# Altium project GL30_A_STM32_FOC_NO_TP.PrjPcb
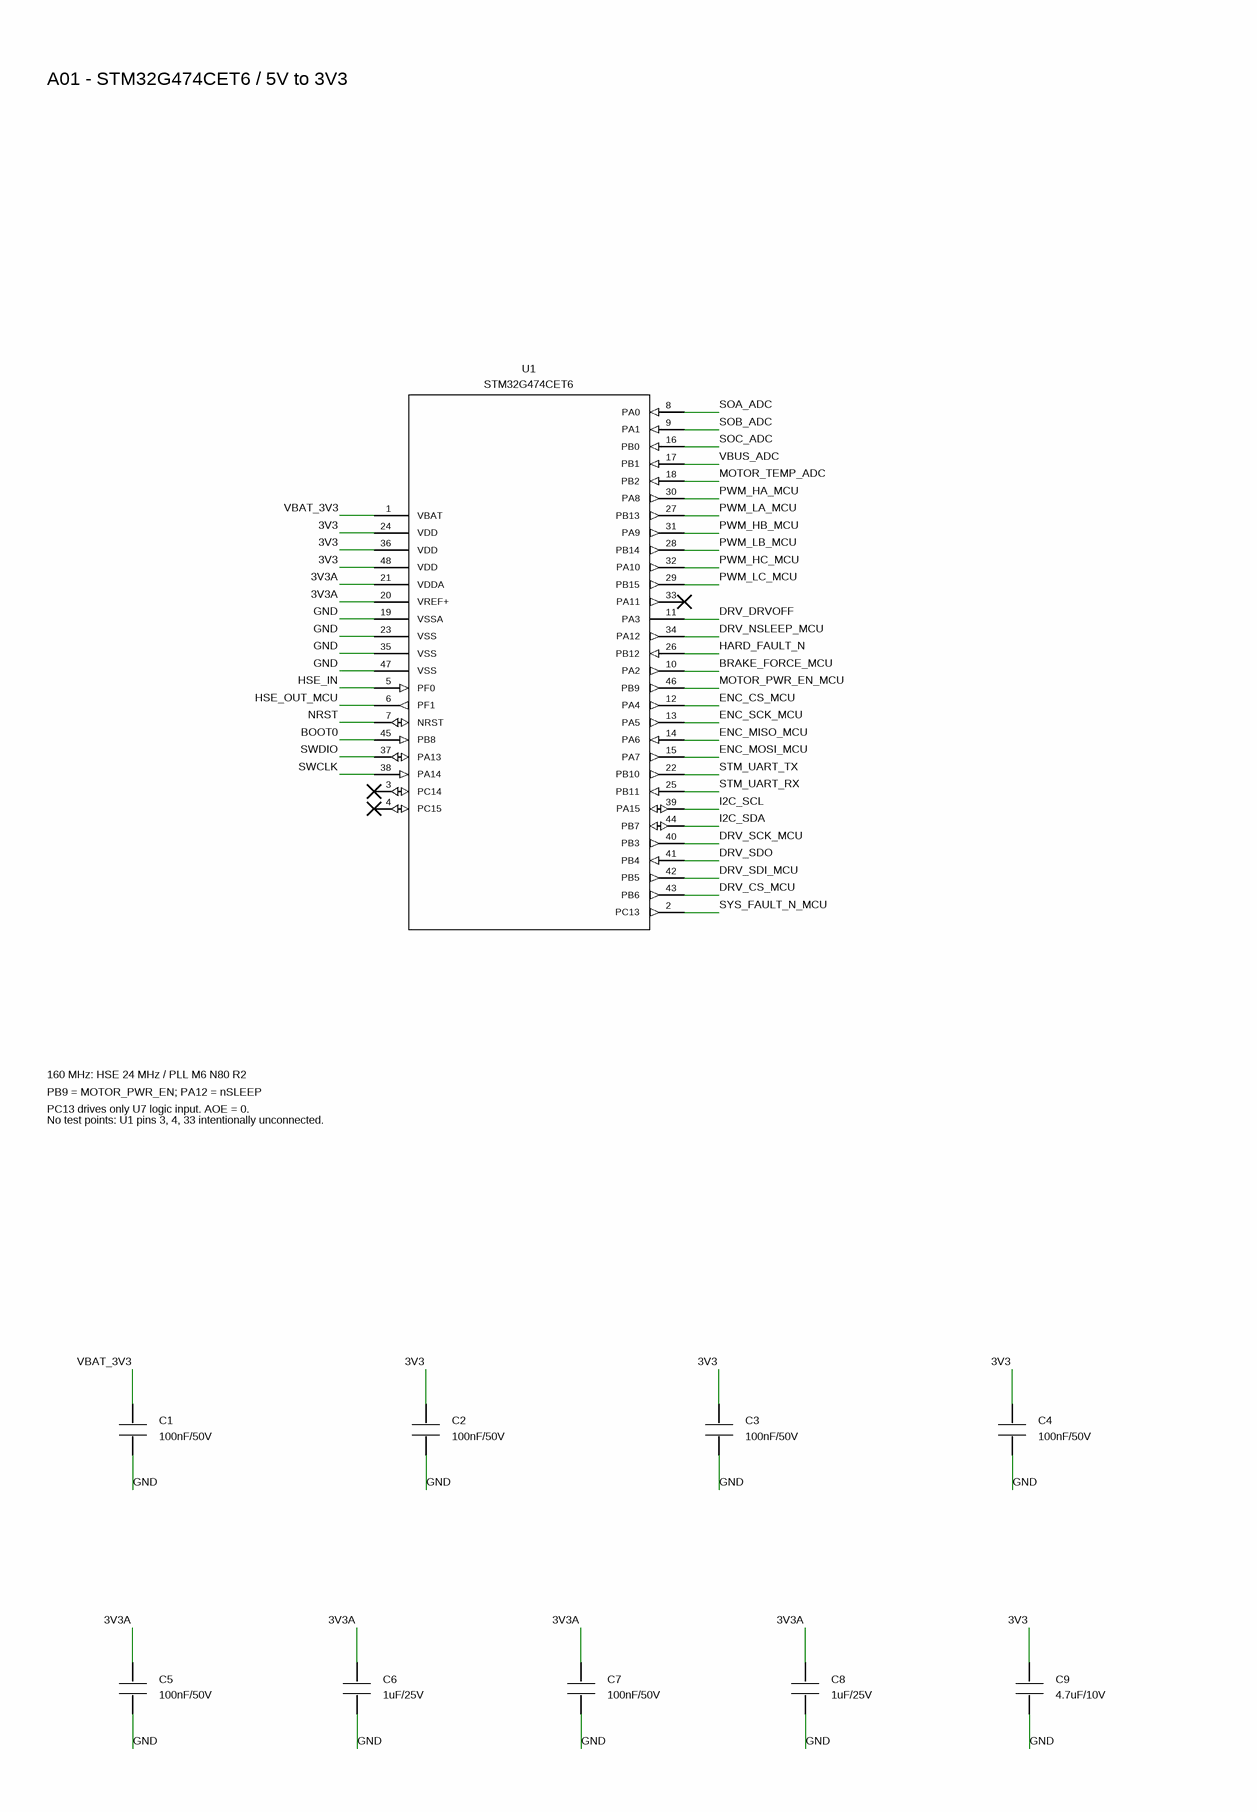
[diagram p0: A01_POWER_MCU.SchDoc, left]
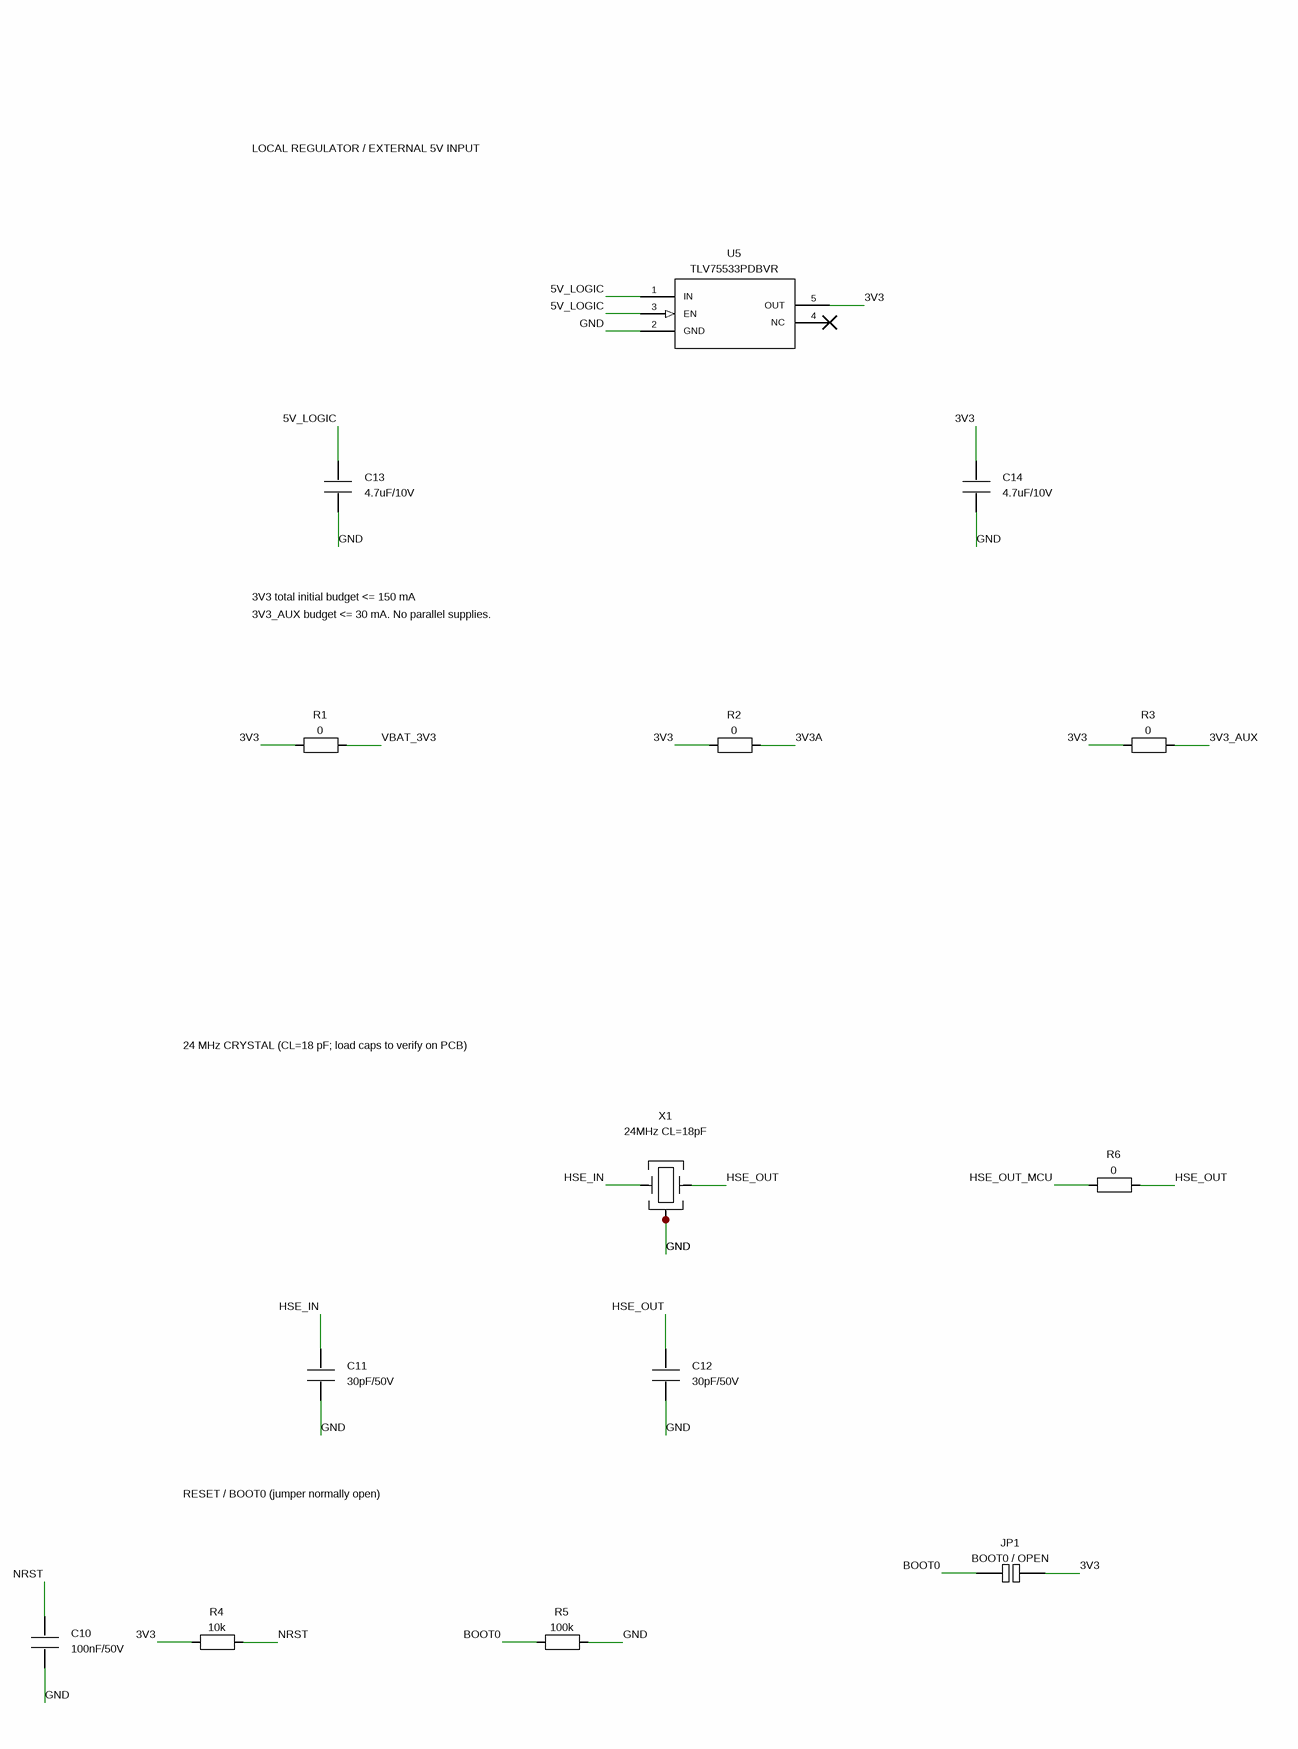
[diagram p1: A01_POWER_MCU.SchDoc, right]
Revision: A-SCH-AD-R6-USER-LIB-NO-TP
7 sheets, 146 parts. Net scope: global (net labels, ports and power ports of the same name join across sheets).
Sheets:
  A01_POWER_MCU.SchDoc
  A02_DRV8316.SchDoc
  A03_CURRENT_ADC.SchDoc
  A04_HARD_PROTECT.SchDoc
  A05_ENCODER_NTC.SchDoc
  A06_LINKS_POWER.SchDoc
  A07_BUS_CONTROL.SchDoc

## Sheet A01_POWER_MCU.SchDoc: A01_POWER_MCU
size 420 x 296 mm; Revision: A-SCH-AD-R2-NO-TP; SheetNumber: 1; SheetTotal: 7

### Parts
C1  100nF/50V  [C0603_M]
C2  100nF/50V  [C0603_M]
C3  100nF/50V  [C0603_M]
C4  100nF/50V  [C0603_M]
C5  100nF/50V  [C0603_M]
C6  1uF/25V  [C0603_M]
C7  100nF/50V  [C0603_M]
C8  1uF/25V  [C0603_M]
C9  4.7uF/10V  [C0805_M]
C10  100nF/50V  [C0603_M]
C11  30pF/50V  [C0603_M]
C12  30pF/50V  [C0603_M]
C13  4.7uF/10V  [C0805_M]
C14  4.7uF/10V  [C0805_M]
JP1  BOOT0 / OPEN
R1  0  [R0603_M]
R2  0  [R0805_M]
R3  0  [R0603_M]
R4  10k  [R0603_M]
R5  100k  [R0603_M]
R6  0  [R0603_M]
U1  STM32G474CET6  [QFP50P900X900X160-48N]
U5  TLV75533PDBVR  [SOT95P280X145-5N]
X1  24MHz CL=18pF  [XTAL-3225-4P]

### Nets
3V3: C2.1 C3.1 C4.1 C9.1 C14.1 JP1.2 R1.1 R2.1 R3.1 R4.1 U1.24(VDD) U1.36(VDD) U1.48(VDD) U5.5(OUT)
3V3_AUX: R3.2
3V3A: C5.1 C6.1 C7.1 C8.1 R2.2 U1.20(VREF+) U1.21(VDDA)
5V_LOGIC: C13.1 U5.1(IN) U5.3(EN)
BOOT0: JP1.1 R5.1 U1.45(PB8)
BRAKE_FORCE_MCU: U1.10(PA2)
DRV_CS_MCU: U1.43(PB6)
DRV_DRVOFF: U1.11(PA3)
DRV_NSLEEP_MCU: U1.34(PA12)
DRV_SCK_MCU: U1.40(PB3)
DRV_SDI_MCU: U1.42(PB5)
DRV_SDO: U1.41(PB4)
ENC_CS_MCU: U1.12(PA4)
ENC_MISO_MCU: U1.14(PA6)
ENC_MOSI_MCU: U1.15(PA7)
ENC_SCK_MCU: U1.13(PA5)
GND: C1.2 C2.2 C3.2 C4.2 C5.2 C6.2 C7.2 C8.2 C9.2 C10.2 C11.2 C12.2 C13.2 C14.2 R5.2 U1.19(VSSA) U1.23(VSS) U1.35(VSS) U1.47(VSS) U5.2(GND) X1.2(G) X1.4(G)
HARD_FAULT_N: U1.26(PB12)
HSE_IN: C11.1 U1.5(PF0) X1.1
HSE_OUT: C12.1 R6.2 X1.3
HSE_OUT_MCU: R6.1 U1.6(PF1)
I2C_SCL: U1.39(PA15)
I2C_SDA: U1.44(PB7)
MOTOR_PWR_EN_MCU: U1.46(PB9)
MOTOR_TEMP_ADC: U1.18(PB2)
NRST: C10.1 R4.2 U1.7(NRST)
PWM_HA_MCU: U1.30(PA8)
PWM_HB_MCU: U1.31(PA9)
PWM_HC_MCU: U1.32(PA10)
PWM_LA_MCU: U1.27(PB13)
PWM_LB_MCU: U1.28(PB14)
PWM_LC_MCU: U1.29(PB15)
SOA_ADC: U1.8(PA0)
SOB_ADC: U1.9(PA1)
SOC_ADC: U1.16(PB0)
STM_UART_RX: U1.25(PB11)
STM_UART_TX: U1.22(PB10)
SWCLK: U1.38(PA14)
SWDIO: U1.37(PA13)
SYS_FAULT_N_MCU: U1.2(PC13)
VBAT_3V3: C1.1 R1.2 U1.1(VBAT)
VBUS_ADC: U1.17(PB1)

Not connected (* = marked no-connect by the designer): U1 3(PC14)* 4(PC15)* 33(PA11)*; U5 4(NC)*

### Notes on the sheet
- A01 - STM32G474CET6 / 5V to 3V3
- LOCAL REGULATOR / EXTERNAL 5V INPUT
- 3V3 total initial budget <= 150 mA
- 3V3_AUX budget <= 30 mA. No parallel supplies.
- 160 MHz: HSE 24 MHz / PLL M6 N80 R2
- PB9 = MOTOR_PWR_EN; PA12 = nSLEEP
- PC13 drives only U7 logic input. AOE = 0.
- No test points: U1 pins 3, 4, 33 intentionally unconnected.
- 24 MHz CRYSTAL (CL=18 pF; load caps to verify on PCB)
- RESET / BOOT0 (jumper normally open)

### Library data of the parts
C1 C10 = C: 电容; MPN: CL10B104KB8NNNC; Source_KiCad_Footprint: GL30:C_0603_1608Metric; Specification: 100 nF / 50 V X7R; Assembly: FITTED; PCB_Model_Status: USER_LIBRARY_LINKED_PIN_NUMBERS_CHECKED; Package: 0603; Footprint_status: LIBRARY_SELECTED_PENDING_LAYOUT_REVIEW; Value: 100nF/50V
C2 = C: 电容; MPN: CL10B104KB8NNNC; Source_KiCad_Footprint: GL30:C_0603_1608Metric; Specification: 100 nF / 50 V X7R; Design_note: 对应U1 VDD脚24; Assembly: FITTED; PCB_Model_Status: USER_LIBRARY_LINKED_PIN_NUMBERS_CHECKED; Package: 0603; Footprint_status: LIBRARY_SELECTED_PENDING_LAYOUT_REVIEW; Value: 100nF/50V
C3 = C: 电容; MPN: CL10B104KB8NNNC; Source_KiCad_Footprint: GL30:C_0603_1608Metric; Specification: 100 nF / 50 V X7R; Design_note: 对应U1 VDD脚36; Assembly: FITTED; PCB_Model_Status: USER_LIBRARY_LINKED_PIN_NUMBERS_CHECKED; Package: 0603; Footprint_status: LIBRARY_SELECTED_PENDING_LAYOUT_REVIEW; Value: 100nF/50V
C4 = C: 电容; MPN: CL10B104KB8NNNC; Source_KiCad_Footprint: GL30:C_0603_1608Metric; Specification: 100 nF / 50 V X7R; Design_note: 对应U1 VDD脚48; Assembly: FITTED; PCB_Model_Status: USER_LIBRARY_LINKED_PIN_NUMBERS_CHECKED; Package: 0603; Footprint_status: LIBRARY_SELECTED_PENDING_LAYOUT_REVIEW; Value: 100nF/50V
C5 = C: 电容; MPN: CL10B104KB8NNNC; Source_KiCad_Footprint: GL30:C_0603_1608Metric; Specification: 100 nF / 50 V X7R; Design_note: U1.21 VDDA; Assembly: FITTED; PCB_Model_Status: USER_LIBRARY_LINKED_PIN_NUMBERS_CHECKED; Package: 0603; Footprint_status: LIBRARY_SELECTED_PENDING_LAYOUT_REVIEW; Value: 100nF/50V
C6 = C: 电容; MPN: CL10A105KA8NNNC; Source_KiCad_Footprint: GL30:C_0603_1608Metric; Specification: 1 µF / 25 V X5R; Design_note: U1.21 VDDA; Assembly: FITTED; PCB_Model_Status: USER_LIBRARY_LINKED_PIN_NUMBERS_CHECKED; Package: 0603; Footprint_status: LIBRARY_SELECTED_PENDING_LAYOUT_REVIEW; Value: 1uF/25V
C7 = C: 电容; MPN: CL10B104KB8NNNC; Source_KiCad_Footprint: GL30:C_0603_1608Metric; Specification: 100 nF / 50 V X7R; Design_note: U1.20 VREF+; Assembly: FITTED; PCB_Model_Status: USER_LIBRARY_LINKED_PIN_NUMBERS_CHECKED; Package: 0603; Footprint_status: LIBRARY_SELECTED_PENDING_LAYOUT_REVIEW; Value: 100nF/50V
C8 = C: 电容; MPN: CL10A105KA8NNNC; Source_KiCad_Footprint: GL30:C_0603_1608Metric; Specification: 1 µF / 25 V X5R; Design_note: U1.20 VREF+; Assembly: FITTED; PCB_Model_Status: USER_LIBRARY_LINKED_PIN_NUMBERS_CHECKED; Package: 0603; Footprint_status: LIBRARY_SELECTED_PENDING_LAYOUT_REVIEW; Value: 1uF/25V
C9 = C: 电容; MPN: 通用 0805 4.7 µF 10 V X7R; Source_KiCad_Footprint: GL30:C_0805_2012Metric; Specification: 4.7 µF / 10 V X7R; Design_note: MCU附近; Assembly: FITTED; PCB_Model_Status: USER_LIBRARY_LINKED_PIN_NUMBERS_CHECKED; Package: 0805; Footprint_status: LIBRARY_SELECTED_PENDING_LAYOUT_REVIEW; Value: 4.7uF/10V
C11 = C: 电容; MPN: 通用 0603 30 pF 50 V C0G; Source_KiCad_Footprint: GL30:C_0603_1608Metric; Specification: 30 pF / 50 V C0G ±5%; Design_note: X1 CL=18pF，按寄生3pF估算；起振后复核; Assembly: FITTED; PCB_Model_Status: USER_LIBRARY_LINKED_PIN_NUMBERS_CHECKED; Package: 0603; Footprint_status: LIBRARY_SELECTED_PENDING_LAYOUT_REVIEW; Value: 30pF/50V
C12 = C: 电容; MPN: 通用 0603 30 pF 50 V C0G; Source_KiCad_Footprint: GL30:C_0603_1608Metric; Specification: 30 pF / 50 V C0G ±5%; Design_note: 不可把晶体CL直接当作单颗负载电容值; Assembly: FITTED; PCB_Model_Status: USER_LIBRARY_LINKED_PIN_NUMBERS_CHECKED; Package: 0603; Footprint_status: LIBRARY_SELECTED_PENDING_LAYOUT_REVIEW; Value: 30pF/50V
C13 = C: 电容; MPN: 通用 0805 4.7 µF 10 V X7R; Source_KiCad_Footprint: GL30:C_0805_2012Metric; Specification: 4.7 µF / 10 V X7R; Design_note: U5输入，有效容量≥1µF; Assembly: FITTED; PCB_Model_Status: USER_LIBRARY_LINKED_PIN_NUMBERS_CHECKED; Package: 0805; Footprint_status: LIBRARY_SELECTED_PENDING_LAYOUT_REVIEW; Value: 4.7uF/10V
C14 = C: 电容; MPN: 通用 0805 4.7 µF 10 V X7R; Source_KiCad_Footprint: GL30:C_0805_2012Metric; Specification: 4.7 µF / 10 V X7R; Design_note: U5输出，有效容量≥1µF; Assembly: FITTED; PCB_Model_Status: USER_LIBRARY_LINKED_PIN_NUMBERS_CHECKED; Package: 0805; Footprint_status: LIBRARY_SELECTED_PENDING_LAYOUT_REVIEW; Value: 4.7uF/10V
JP1 = SolderJumper_2_Open: BOOT焊桥; MPN: PCB焊盘，无采购; Source_KiCad_Footprint: GL30:SolderJumper-2_P1.3mm_Open_RoundedPad1.0x1.5mm; Specification: 默认断开; Design_note: 只在烧录/救援时短接; Assembly: DNP_OR_DIRECT_WIRE_PADS; PCB_Model_Status: NOT_ASSIGNED_IN_ALTIUM_SCHEMATIC_DELIVERY; Package: 2焊盘焊桥; Footprint_status: LIBRARY_SELECTED_PENDING_LAYOUT_REVIEW; Value: BOOT0 / OPEN
R1 = R: 电阻; MPN: 通用0Ω跳线 0.1 W; Source_KiCad_Footprint: GL30:R_0603_1608Metric; Specification: 0 Ω跳线；0.1 W; Assembly: FITTED; PCB_Model_Status: USER_LIBRARY_LINKED_PIN_NUMBERS_CHECKED; Package: 0603; Footprint_status: LIBRARY_SELECTED_PENDING_LAYOUT_REVIEW; Value: 0
R2 = R: 电阻; MPN: 通用0Ω跳线 0.125 W; Source_KiCad_Footprint: GL30:R_0805_2012Metric; Specification: 0 Ω跳线；0.125 W; Design_note: 0805磁珠兼容焊盘；首装0Ω，不将模拟地割裂; Assembly: FITTED; PCB_Model_Status: USER_LIBRARY_LINKED_PIN_NUMBERS_CHECKED; Package: 0805; Footprint_status: LIBRARY_SELECTED_PENDING_LAYOUT_REVIEW; Value: 0
R3 = R: 电阻; MPN: 通用0Ω跳线 0.1 W; Source_KiCad_Footprint: GL30:R_0603_1608Metric; Specification: 0 Ω跳线；0.1 W; Design_note: 可拆以单独测B/C传感器电流; Assembly: FITTED; PCB_Model_Status: USER_LIBRARY_LINKED_PIN_NUMBERS_CHECKED; Package: 0603; Footprint_status: LIBRARY_SELECTED_PENDING_LAYOUT_REVIEW; Value: 0
R4 = R: 电阻; MPN: 通用厚膜 10k 1% 0.1 W; Source_KiCad_Footprint: GL30:R_0603_1608Metric; Specification: 10k Ω；1%；0.1 W; Assembly: FITTED; PCB_Model_Status: USER_LIBRARY_LINKED_PIN_NUMBERS_CHECKED; Package: 0603; Footprint_status: LIBRARY_SELECTED_PENDING_LAYOUT_REVIEW; Value: 10k
R5 = R: 电阻; MPN: 通用厚膜 100k 1% 0.1 W; Source_KiCad_Footprint: GL30:R_0603_1608Metric; Specification: 100k Ω；1%；0.1 W; Assembly: FITTED; PCB_Model_Status: USER_LIBRARY_LINKED_PIN_NUMBERS_CHECKED; Package: 0603; Footprint_status: LIBRARY_SELECTED_PENDING_LAYOUT_REVIEW; Value: 100k
R6 = R: 电阻; MPN: 通用0Ω跳线 0.1 W; Source_KiCad_Footprint: GL30:R_0603_1608Metric; Specification: 0 Ω跳线；0.1 W; Design_note: 晶体驱动调试位置，首装0Ω; Assembly: FITTED; PCB_Model_Status: USER_LIBRARY_LINKED_PIN_NUMBERS_CHECKED; Package: 0603; Footprint_status: LIBRARY_SELECTED_PENDING_LAYOUT_REVIEW; Value: 0
U1 = STM32G474CET6: FOC主控; Source_KiCad_Footprint: GL30:LQFP-48_7x7mm_P0.5mm; Design_note: 必须选CET6；不是NUCLEO上的RET6; Assembly: FITTED; PCB_Model_Status: USER_LIBRARY_LINKED_PIN_NUMBERS_CHECKED; Datasheet: https://www.st.com/resource/en/datasheet/stm32g474ce.pdf; MPN: STM32G474CET6; Package: LQFP48 7×7 mm，0.5 mm; Specification: STM32G474CET6; Footprint_status: LIBRARY_SELECTED_PENDING_LAYOUT_REVIEW; Value: STM32G474CET6
U5 = TLV75533PDBVR: 本地3.3 V稳压; Source_KiCad_Footprint: GL30:SOT-23-5; Design_note: 原B板B10不删除；本板3V3禁止与B/ESP的独立3V3并联; Assembly: FITTED; PCB_Model_Status: USER_LIBRARY_LINKED_PIN_NUMBERS_CHECKED; Datasheet: https://www.ti.com/lit/ds/symlink/tlv755p.pdf; MPN: TLV75533PDBVR; Package: DBV SOT-23-5; Specification: TLV75533PDBVR; Footprint_status: LIBRARY_SELECTED_PENDING_LAYOUT_REVIEW; Value: TLV75533PDBVR
X1 = Crystal_GND24: 无源晶体; MPN: ABM8-24.000MHZ-B2-T; Source_KiCad_Footprint: GL30:Crystal_SMD_3225-4Pin_3.2x2.5mm; Specification: 24 MHz；CL18 pF; Design_note: 1/3晶体，2/4外壳地；不可按倒角判1脚; Assembly: FITTED; PCB_Model_Status: USER_LIBRARY_LINKED_PIN_NUMBERS_CHECKED; Package: 3225 4焊盘; Footprint_status: LIBRARY_SELECTED_PENDING_LAYOUT_REVIEW; Value: 24MHz CL=18pF

## Sheet A02_DRV8316.SchDoc: A02_DRV8316
size 420 x 296 mm; Revision: A-SCH-AD-R2-NO-TP; SheetNumber: 2; SheetTotal: 7
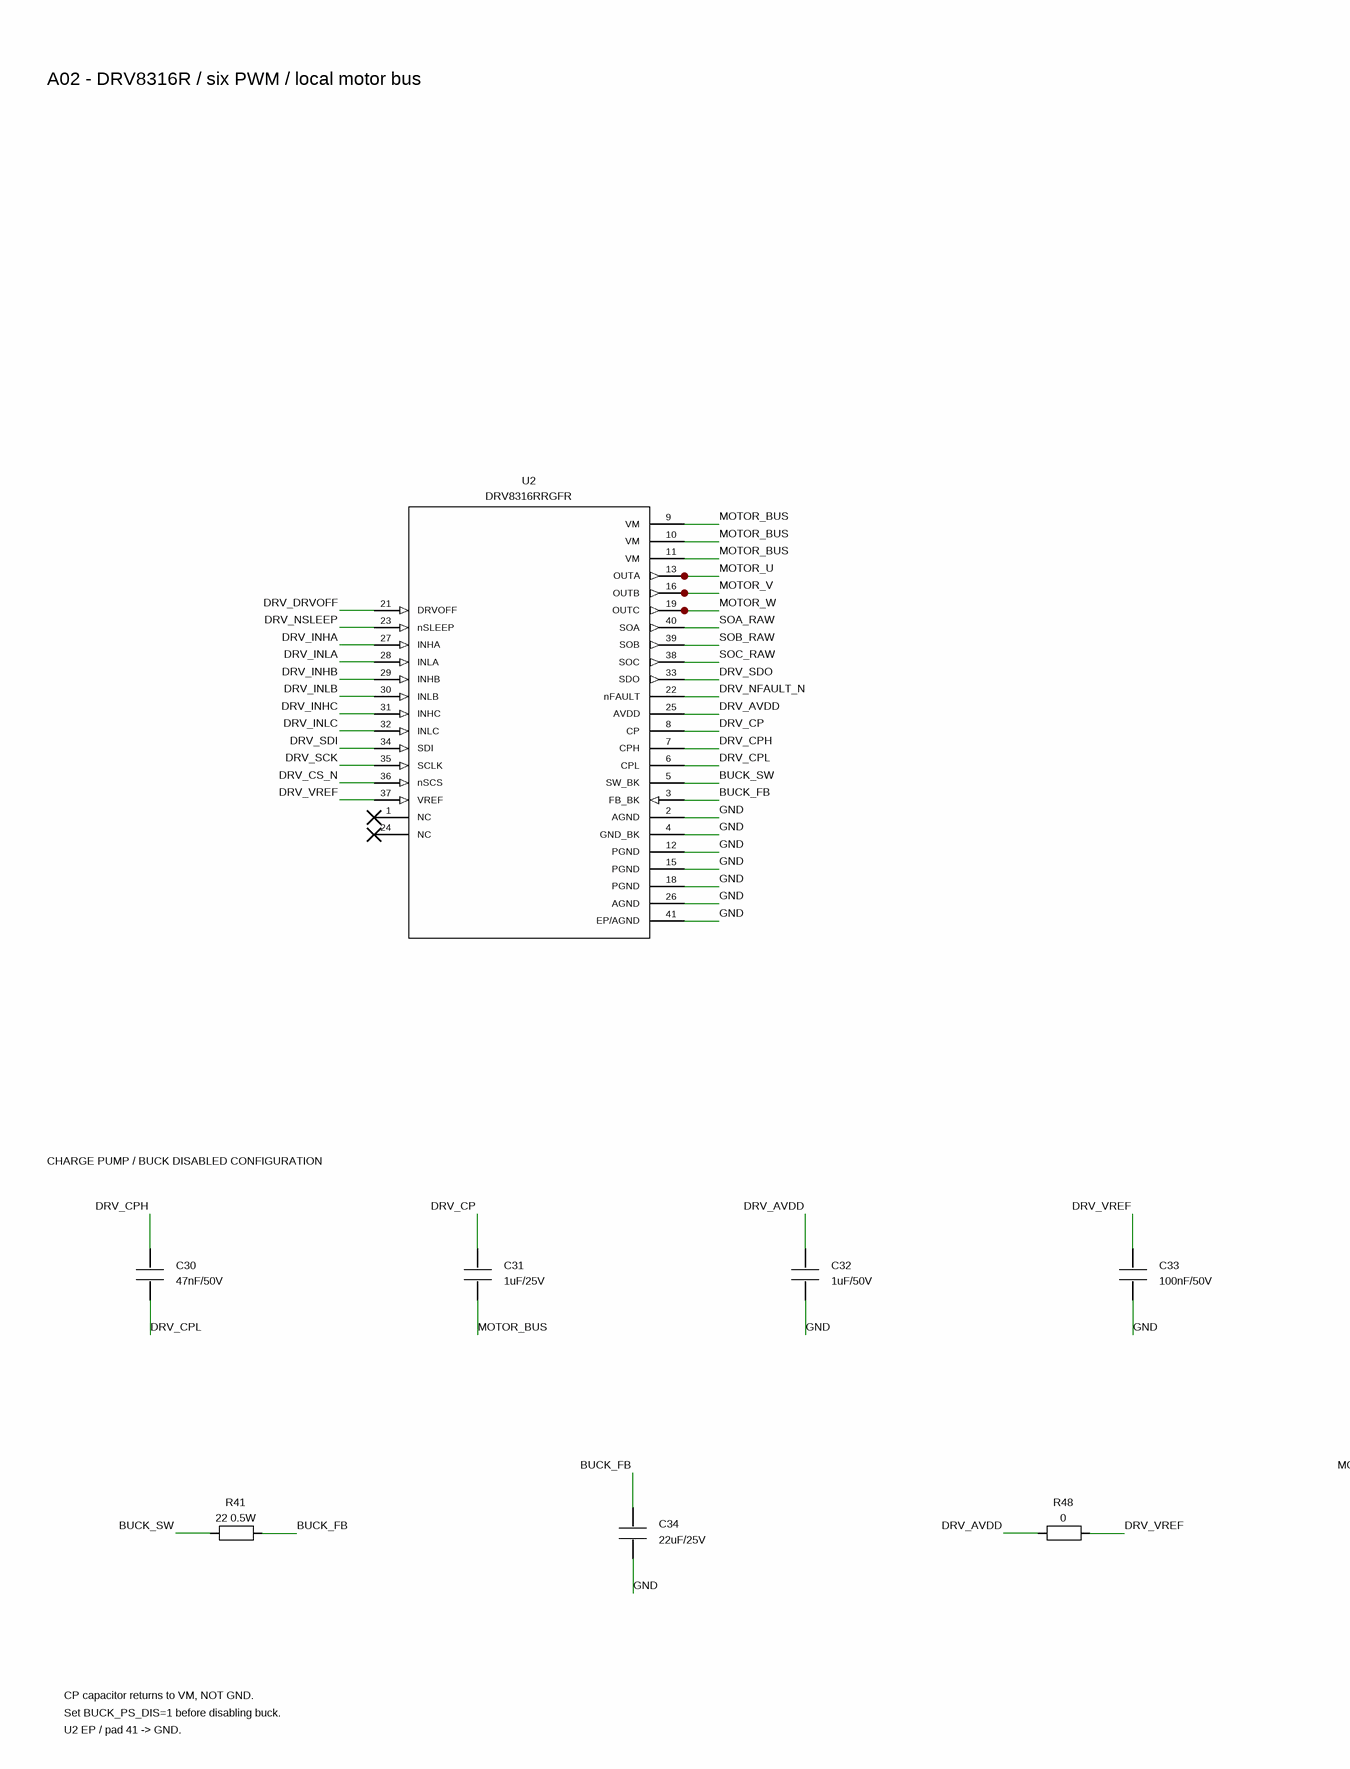
[diagram p2: A02_DRV8316.SchDoc, left]
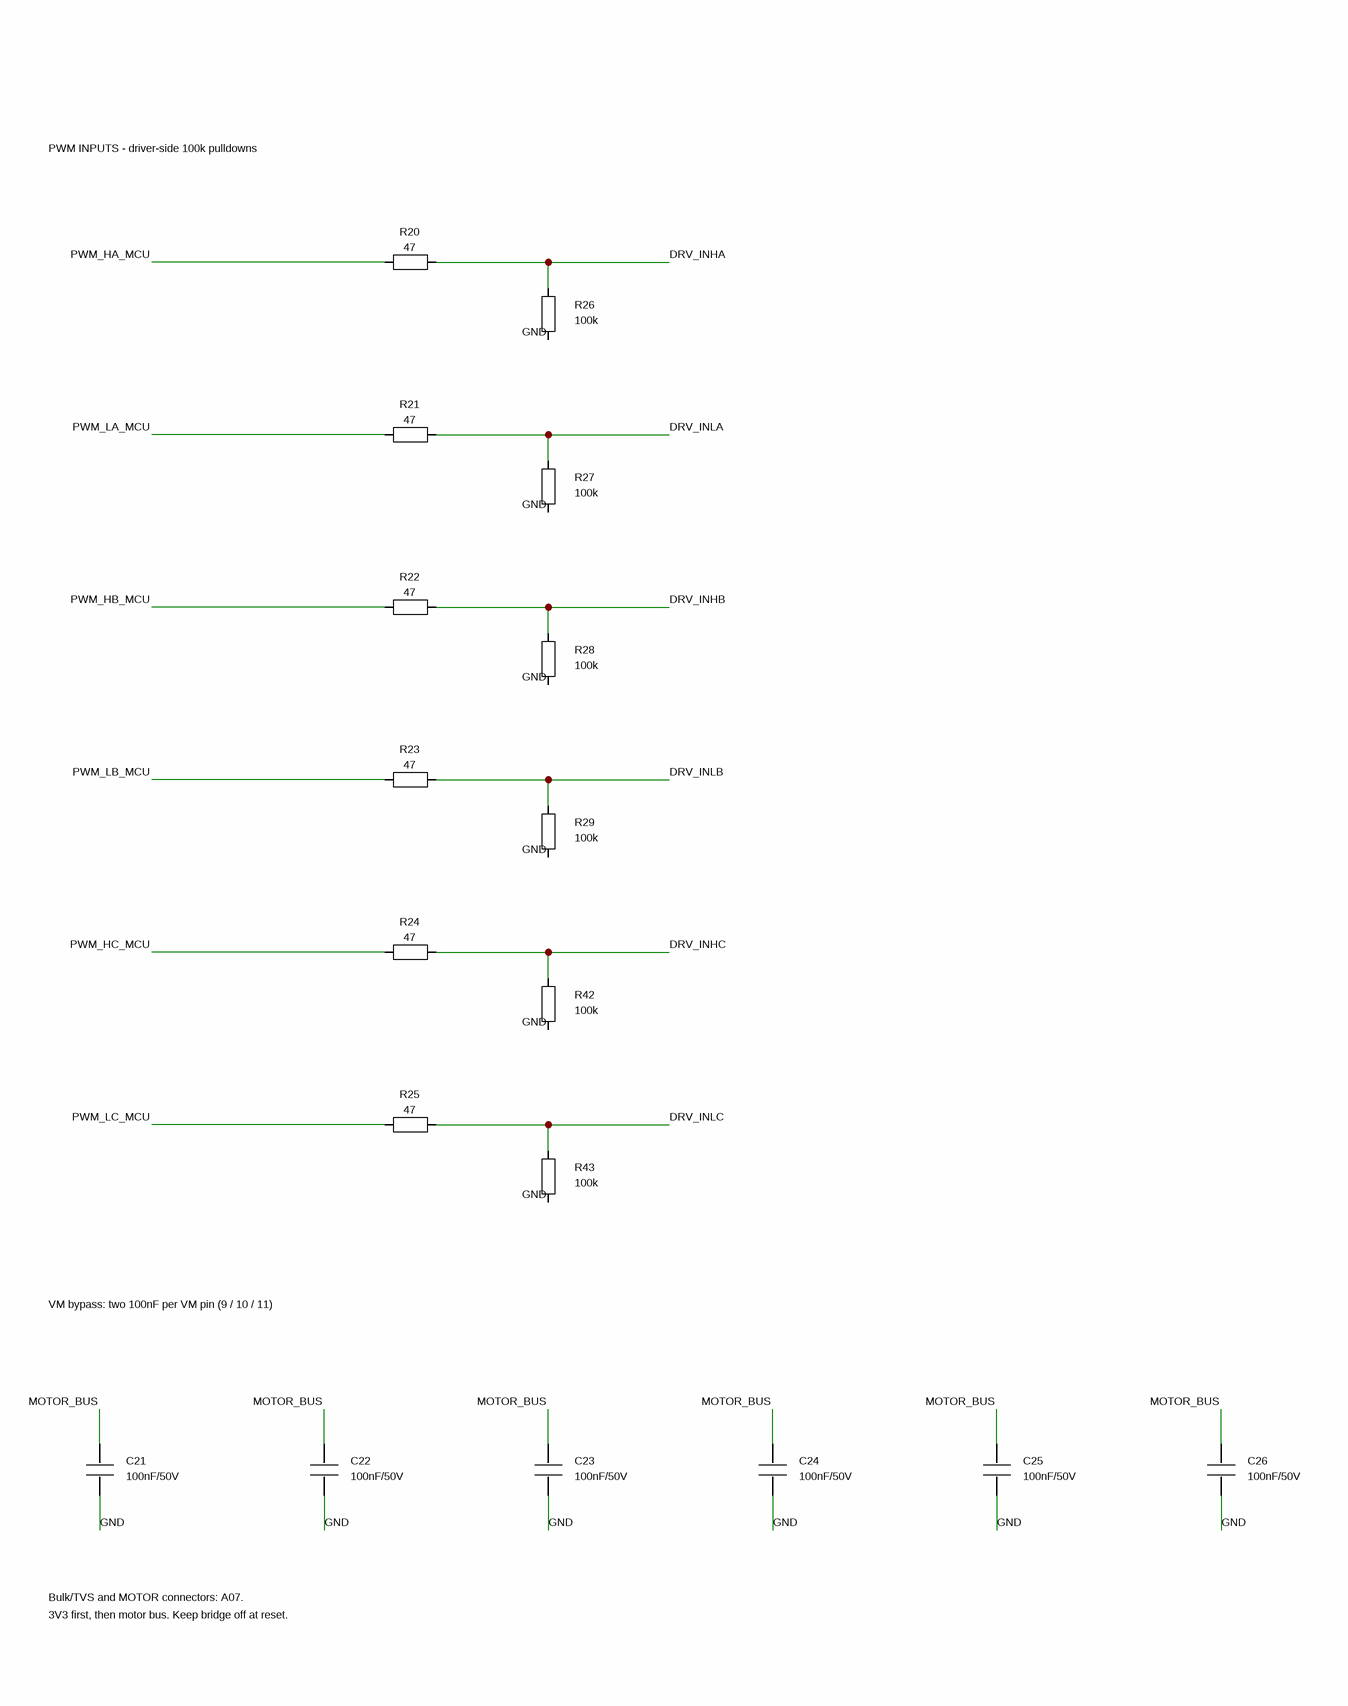
[diagram p3: A02_DRV8316.SchDoc, right]

### Parts
C21  100nF/50V  [C0603_M]
C22  100nF/50V  [C0603_M]
C23  100nF/50V  [C0603_M]
C24  100nF/50V  [C0603_M]
C25  100nF/50V  [C0603_M]
C26  100nF/50V  [C0603_M]
C30  47nF/50V  [C0603_M]
C31  1uF/25V  [C0603_M]
C32  1uF/50V  [C0805_M]
C33  100nF/50V  [C0603_M]
C34  22uF/25V  [C0805_M]
R20  47  [R0603_M]
R21  47  [R0603_M]
R22  47  [R0603_M]
R23  47  [R0603_M]
R24  47  [R0603_M]
R25  47  [R0603_M]
R26  100k  [R0603_M]
R27  100k  [R0603_M]
R28  100k  [R0603_M]
R29  100k  [R0603_M]
R41  22 0.5W  [RESC3116X65N]
R42  100k  [R0603_M]
R43  100k  [R0603_M]
R48  0  [R0603_M]
U2  DRV8316RRGFR  [C5218861_VQFN-40_5x7]

### Nets
BUCK_FB: C34.1 R41.2 U2.3(FB_BK)
BUCK_SW: R41.1 U2.5(SW_BK)
DRV_AVDD: C32.1 R48.1 U2.25(AVDD)
DRV_CP: C31.1 U2.8(CP)
DRV_CPH: C30.1 U2.7(CPH)
DRV_CPL: C30.2 U2.6(CPL)
DRV_CS_N: U2.36(nSCS)
DRV_DRVOFF: U2.21(DRVOFF)
DRV_INHA: R20.2 R26.1 U2.27(INHA)
DRV_INHB: R22.2 R28.1 U2.29(INHB)
DRV_INHC: R24.2 R42.1 U2.31(INHC)
DRV_INLA: R21.2 R27.1 U2.28(INLA)
DRV_INLB: R23.2 R29.1 U2.30(INLB)
DRV_INLC: R25.2 R43.1 U2.32(INLC)
DRV_NFAULT_N: U2.22(nFAULT)
DRV_NSLEEP: U2.23(nSLEEP)
DRV_SCK: U2.35(SCLK)
DRV_SDI: U2.34(SDI)
DRV_SDO: U2.33(SDO)
DRV_VREF: C33.1 R48.2 U2.37(VREF)
GND: C21.2 C22.2 C23.2 C24.2 C25.2 C26.2 C32.2 C33.2 C34.2 R26.2 R27.2 R28.2 R29.2 R42.2 R43.2 U2.2(AGND) U2.4(GND_BK) U2.12(PGND) U2.15(PGND) U2.18(PGND) U2.26(AGND) U2.41(EP/AGND)
MOTOR_BUS: C21.1 C22.1 C23.1 C24.1 C25.1 C26.1 C31.2 U2.9(VM) U2.10(VM) U2.11(VM)
MOTOR_U: U2.13(OUTA) U2.14(OUTA)
MOTOR_V: U2.16(OUTB) U2.17(OUTB)
MOTOR_W: U2.19(OUTC) U2.20(OUTC)
PWM_HA_MCU: R20.1
PWM_HB_MCU: R22.1
PWM_HC_MCU: R24.1
PWM_LA_MCU: R21.1
PWM_LB_MCU: R23.1
PWM_LC_MCU: R25.1
SOA_RAW: U2.40(SOA)
SOB_RAW: U2.39(SOB)
SOC_RAW: U2.38(SOC)

Not connected (* = marked no-connect by the designer): U2 1(NC)* 24(NC)*

### Notes on the sheet
- A02 - DRV8316R / six PWM / local motor bus
- PWM INPUTS - driver-side 100k pulldowns
- CHARGE PUMP / BUCK DISABLED CONFIGURATION
- VM bypass: two 100nF per VM pin (9 / 10 / 11)
- CP capacitor returns to VM, NOT GND.
- Bulk/TVS and MOTOR connectors: A07.
- 3V3 first, then motor bus. Keep bridge off at reset.
- Set BUCK_PS_DIS=1 before disabling buck.
- U2 EP / pad 41 -> GND.

### Library data of the parts
C21 = C: 电容; MPN: CL10B104KB8NNNC; Source_KiCad_Footprint: GL30:C_0603_1608Metric; Specification: 100 nF / 50 V X7R; Design_note: VM脚9的第1颗，就近; Assembly: FITTED; PCB_Model_Status: USER_LIBRARY_LINKED_PIN_NUMBERS_CHECKED; Package: 0603; Footprint_status: LIBRARY_SELECTED_PENDING_LAYOUT_REVIEW; Value: 100nF/50V
C22 = C: 电容; MPN: CL10B104KB8NNNC; Source_KiCad_Footprint: GL30:C_0603_1608Metric; Specification: 100 nF / 50 V X7R; Design_note: VM脚9的第2颗，就近; Assembly: FITTED; PCB_Model_Status: USER_LIBRARY_LINKED_PIN_NUMBERS_CHECKED; Package: 0603; Footprint_status: LIBRARY_SELECTED_PENDING_LAYOUT_REVIEW; Value: 100nF/50V
C23 = C: 电容; MPN: CL10B104KB8NNNC; Source_KiCad_Footprint: GL30:C_0603_1608Metric; Specification: 100 nF / 50 V X7R; Design_note: VM脚10的第1颗，就近; Assembly: FITTED; PCB_Model_Status: USER_LIBRARY_LINKED_PIN_NUMBERS_CHECKED; Package: 0603; Footprint_status: LIBRARY_SELECTED_PENDING_LAYOUT_REVIEW; Value: 100nF/50V
C24 = C: 电容; MPN: CL10B104KB8NNNC; Source_KiCad_Footprint: GL30:C_0603_1608Metric; Specification: 100 nF / 50 V X7R; Design_note: VM脚10的第2颗，就近; Assembly: FITTED; PCB_Model_Status: USER_LIBRARY_LINKED_PIN_NUMBERS_CHECKED; Package: 0603; Footprint_status: LIBRARY_SELECTED_PENDING_LAYOUT_REVIEW; Value: 100nF/50V
C25 = C: 电容; MPN: CL10B104KB8NNNC; Source_KiCad_Footprint: GL30:C_0603_1608Metric; Specification: 100 nF / 50 V X7R; Design_note: VM脚11的第1颗，就近; Assembly: FITTED; PCB_Model_Status: USER_LIBRARY_LINKED_PIN_NUMBERS_CHECKED; Package: 0603; Footprint_status: LIBRARY_SELECTED_PENDING_LAYOUT_REVIEW; Value: 100nF/50V
C26 = C: 电容; MPN: CL10B104KB8NNNC; Source_KiCad_Footprint: GL30:C_0603_1608Metric; Specification: 100 nF / 50 V X7R; Design_note: VM脚11的第2颗，就近; Assembly: FITTED; PCB_Model_Status: USER_LIBRARY_LINKED_PIN_NUMBERS_CHECKED; Package: 0603; Footprint_status: LIBRARY_SELECTED_PENDING_LAYOUT_REVIEW; Value: 100nF/50V
C30 = C: 电容; MPN: CL10B473KB8NNNC; Source_KiCad_Footprint: GL30:C_0603_1608Metric; Specification: 47 nF / 50 V X7R; Design_note: 飞跨电容；不是接地; Assembly: FITTED; PCB_Model_Status: USER_LIBRARY_LINKED_PIN_NUMBERS_CHECKED; Package: 0603; Footprint_status: LIBRARY_SELECTED_PENDING_LAYOUT_REVIEW; Value: 47nF/50V
C31 = C: 电容; MPN: CL10A105KA8NNNC; Source_KiCad_Footprint: GL30:C_0603_1608Metric; Specification: 1 µF / 25 V X5R; Design_note: 充电泵电容；不是CP接地; Assembly: FITTED; PCB_Model_Status: USER_LIBRARY_LINKED_PIN_NUMBERS_CHECKED; Package: 0603; Footprint_status: LIBRARY_SELECTED_PENDING_LAYOUT_REVIEW; Value: 1uF/25V
C32 = C: 电容; MPN: CL21B105KBFNNNE; Source_KiCad_Footprint: GL30:C_0805_2012Metric; Specification: 1 µF / 50 V X7R; Design_note: 需在3.3V/全温下有效0.7–1.3µF；按实购曲线复核; Assembly: FITTED; PCB_Model_Status: USER_LIBRARY_LINKED_PIN_NUMBERS_CHECKED; Package: 0805; Footprint_status: LIBRARY_SELECTED_PENDING_LAYOUT_REVIEW; Value: 1uF/50V
C33 = C: as C1 on sheet A01_POWER_MCU; Package: 0603; Footprint_status: LIBRARY_SELECTED_PENDING_LAYOUT_REVIEW; Value: 100nF/50V
C34 = C: 电容; MPN: CL21A226MAQNNNE; Source_KiCad_Footprint: GL30:C_0805_2012Metric; Specification: 22 µF / 25 V X5R; Design_note: 内部Buck未使用仍装；5V_LOGIC不能接这里; Assembly: FITTED; PCB_Model_Status: USER_LIBRARY_LINKED_PIN_NUMBERS_CHECKED; Package: 0805; Footprint_status: LIBRARY_SELECTED_PENDING_LAYOUT_REVIEW; Value: 22uF/25V
R20-R25 = R: 电阻; MPN: 通用厚膜 47 1% 0.1 W; Source_KiCad_Footprint: GL30:R_0603_1608Metric; Specification: 47 Ω；1%；0.1 W; Assembly: FITTED; PCB_Model_Status: USER_LIBRARY_LINKED_PIN_NUMBERS_CHECKED; Package: 0603; Footprint_status: LIBRARY_SELECTED_PENDING_LAYOUT_REVIEW; Value: 47
R26-R29 R42 R43 = R: 电阻; MPN: 通用厚膜 100k 1% 0.1 W; Source_KiCad_Footprint: GL30:R_0603_1608Metric; Specification: 100k Ω；1%；0.1 W; Design_note: 放驱动器侧; Assembly: FITTED; PCB_Model_Status: USER_LIBRARY_LINKED_PIN_NUMBERS_CHECKED; Package: 0603; Footprint_status: LIBRARY_SELECTED_PENDING_LAYOUT_REVIEW; Value: 100k
R41 = R: 电阻; MPN: 通用厚膜 22 1% 0.5 W; Source_KiCad_Footprint: GL30:R_1206_3216Metric; Specification: 22 Ω；1%；0.5 W; Design_note: 内部Buck不用也保留；脉冲型≥0.5W，不能替成0603; Assembly: FITTED; PCB_Model_Status: USER_LIBRARY_LINKED_PIN_NUMBERS_CHECKED; Package: 1206; Footprint_status: LIBRARY_SELECTED_PENDING_LAYOUT_REVIEW; Value: 22 0.5W
R48 = R: as R1 on sheet A01_POWER_MCU; Package: 0603; Footprint_status: LIBRARY_SELECTED_PENDING_LAYOUT_REVIEW; Value: 0
U2 = DRV8316RRGFR: 三相集成驱动; Design_note: R版SPI；每个VM脚配2颗100n；裸露焊盘必须接地; Assembly: FITTED; PCB_Model_Status: USER_LIBRARY_LINKED_PIN_NUMBERS_CHECKED; Datasheet: https://www.ti.com/lit/ds/symlink/drv8316.pdf; MPN: DRV8316RRGFR; Package: RGF VQFN40 7×5 mm + EP; Specification: DRV8316RRGFR; Footprint_status: PENDING_PHYSICAL_FOOTPRINT_REVIEW; Value: DRV8316RRGFR

## Sheet A03_CURRENT_ADC.SchDoc: A03_CURRENT_ADC
size 420 x 296 mm; Revision: A-SCH-AD-R2-NO-TP; SheetNumber: 3; SheetTotal: 7
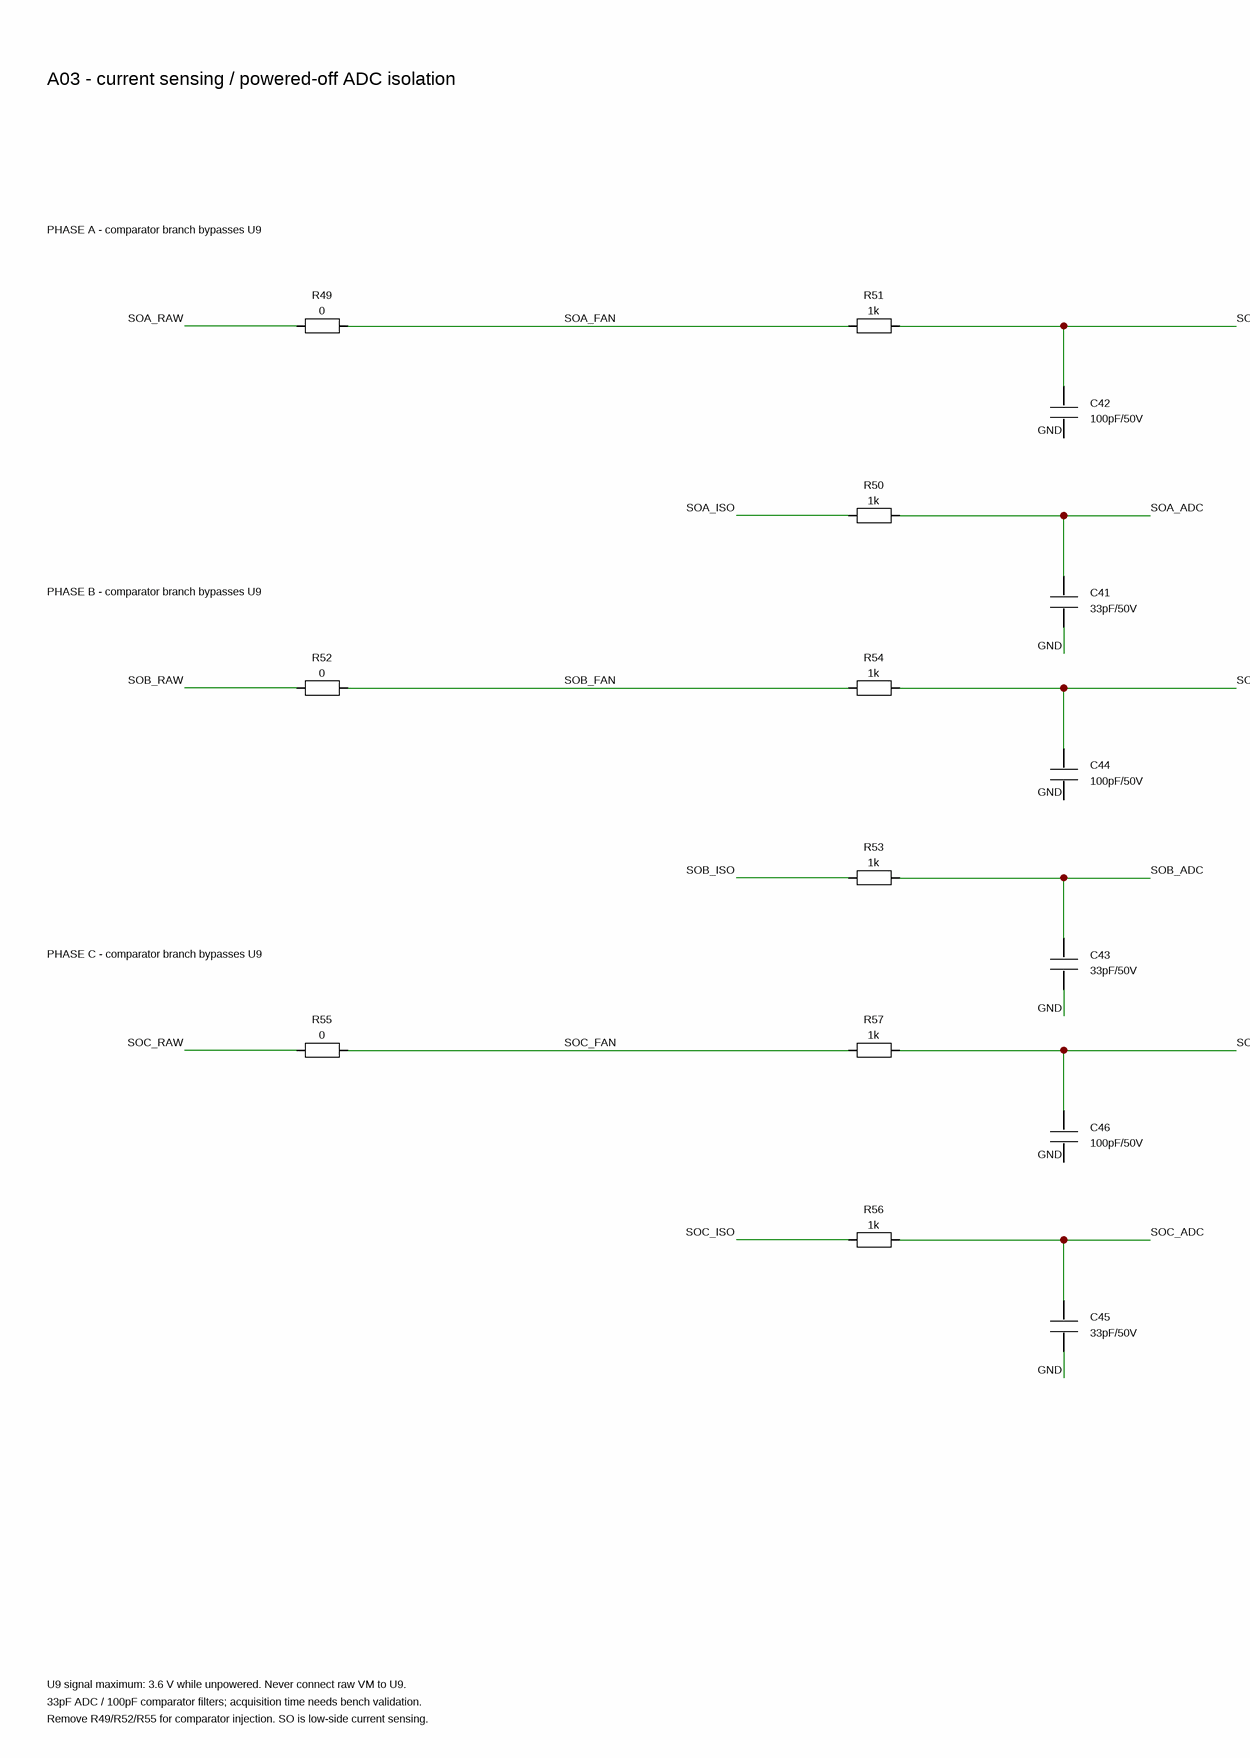
[diagram p4: A03_CURRENT_ADC.SchDoc, left]
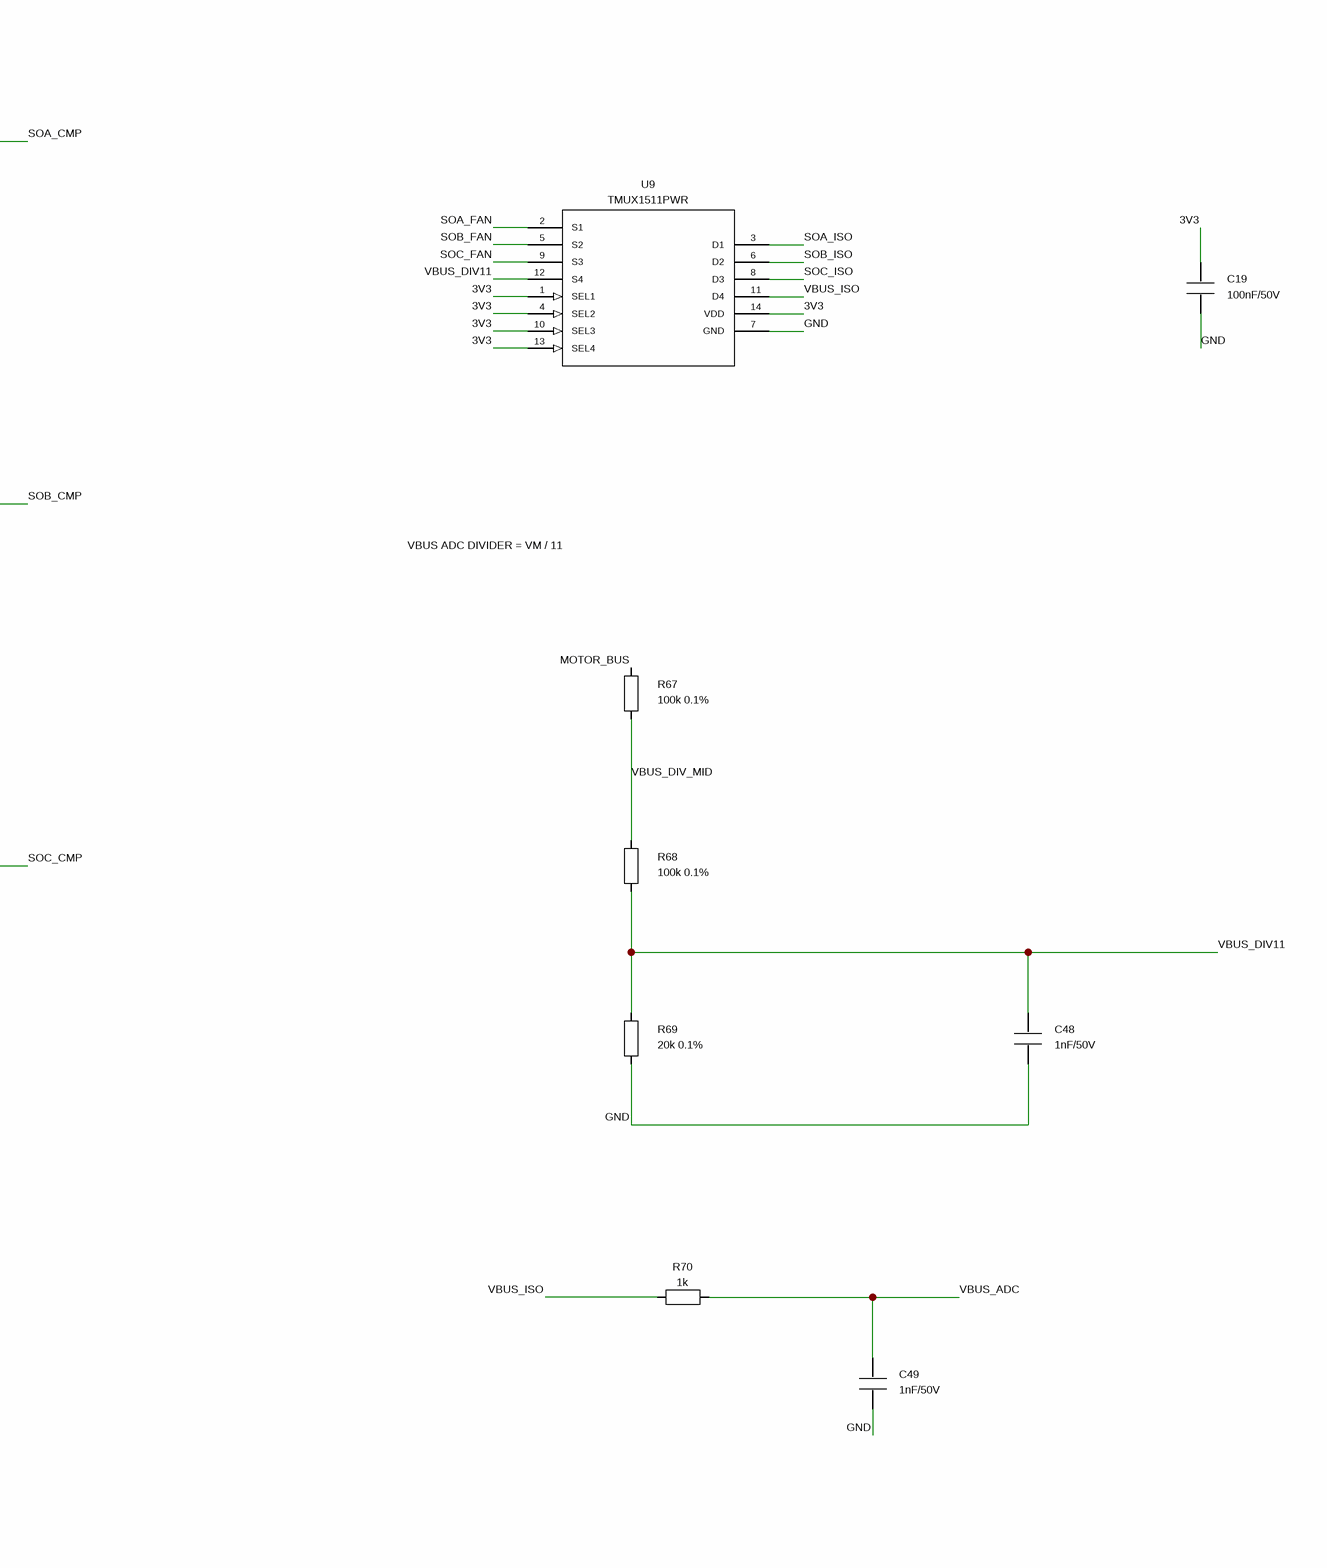
[diagram p5: A03_CURRENT_ADC.SchDoc, right]

### Parts
C19  100nF/50V  [C0603_M]
C41  33pF/50V  [C0603_M]
C42  100pF/50V  [C0603_M]
C43  33pF/50V  [C0603_M]
C44  100pF/50V  [C0603_M]
C45  33pF/50V  [C0603_M]
C46  100pF/50V  [C0603_M]
C48  1nF/50V  [C0603_M]
C49  1nF/50V  [C0603_M]
R49  0  [R0603_M]
R50  1k  [R0603_M]
R51  1k  [R0603_M]
R52  0  [R0603_M]
R53  1k  [R0603_M]
R54  1k  [R0603_M]
R55  0  [R0603_M]
R56  1k  [R0603_M]
R57  1k  [R0603_M]
R67  100k 0.1%  [R0603_M]
R68  100k 0.1%  [R0603_M]
R69  20k 0.1%  [R0603_M]
R70  1k  [R0603_M]
U9  TMUX1511PWR  [SOP65P640X120-14N]

### Nets
3V3: C19.1 U9.1(SEL1) U9.4(SEL2) U9.10(SEL3) U9.13(SEL4) U9.14(VDD)
GND: C19.2 C41.2 C42.2 C43.2 C44.2 C45.2 C46.2 C48.2 C49.2 R69.2 U9.7(GND)
MOTOR_BUS: R67.1
SOA_ADC: C41.1 R50.2
SOA_CMP: C42.1 R51.2
SOA_FAN: R49.2 R51.1 U9.2(S1)
SOA_ISO: R50.1 U9.3(D1)
SOA_RAW: R49.1
SOB_ADC: C43.1 R53.2
SOB_CMP: C44.1 R54.2
SOB_FAN: R52.2 R54.1 U9.5(S2)
SOB_ISO: R53.1 U9.6(D2)
SOB_RAW: R52.1
SOC_ADC: C45.1 R56.2
SOC_CMP: C46.1 R57.2
SOC_FAN: R55.2 R57.1 U9.9(S3)
SOC_ISO: R56.1 U9.8(D3)
SOC_RAW: R55.1
VBUS_ADC: C49.1 R70.2
VBUS_DIV11: C48.1 R68.2 R69.1 U9.12(S4)
VBUS_DIV_MID: R67.2 R68.1
VBUS_ISO: R70.1 U9.11(D4)

### Notes on the sheet
- A03 - current sensing / powered-off ADC isolation
- PHASE A - comparator branch bypasses U9
- PHASE B - comparator branch bypasses U9
- VBUS ADC DIVIDER = VM / 11
- PHASE C - comparator branch bypasses U9
- U9 signal maximum: 3.6 V while unpowered. Never connect raw VM to U9.
- 33pF ADC / 100pF comparator filters; acquisition time needs bench validation.
- Remove R49/R52/R55 for comparator injection. SO is low-side current sensing.

### Library data of the parts
C19 = C: 电容; MPN: CL10B104KB8NNNC; Source_KiCad_Footprint: GL30:C_0603_1608Metric; Specification: 100 nF / 50 V X7R; Design_note: U9.14; Assembly: FITTED; PCB_Model_Status: USER_LIBRARY_LINKED_PIN_NUMBERS_CHECKED; Package: 0603; Footprint_status: LIBRARY_SELECTED_PENDING_LAYOUT_REVIEW; Value: 100nF/50V
C41 C43 C45 = C: 电容; MPN: CC0603JRNPO9BN330; Source_KiCad_Footprint: GL30:C_0603_1608Metric; Specification: 33 pF / 50 V C0G ±5%; Assembly: FITTED; PCB_Model_Status: USER_LIBRARY_LINKED_PIN_NUMBERS_CHECKED; Package: 0603; Footprint_status: LIBRARY_SELECTED_PENDING_LAYOUT_REVIEW; Value: 33pF/50V
C42 C44 C46 = C: 电容; MPN: CC0603JRNPO9BN101; Source_KiCad_Footprint: GL30:C_0603_1608Metric; Specification: 100 pF / 50 V C0G ±5%; Assembly: FITTED; PCB_Model_Status: USER_LIBRARY_LINKED_PIN_NUMBERS_CHECKED; Package: 0603; Footprint_status: LIBRARY_SELECTED_PENDING_LAYOUT_REVIEW; Value: 100pF/50V
C48 C49 = C: 电容; MPN: CL10B102KB8NNNC; Source_KiCad_Footprint: GL30:C_0603_1608Metric; Specification: 1 nF / 50 V X7R; Assembly: FITTED; PCB_Model_Status: USER_LIBRARY_LINKED_PIN_NUMBERS_CHECKED; Package: 0603; Footprint_status: LIBRARY_SELECTED_PENDING_LAYOUT_REVIEW; Value: 1nF/50V
R49 R52 R55 = R: 电阻; MPN: 通用0Ω跳线 0.1 W; Source_KiCad_Footprint: GL30:R_0603_1608Metric; Specification: 0 Ω跳线；0.1 W; Design_note: 注入校验前拆开；禁止外部源顶入DRV输出; Assembly: FITTED; PCB_Model_Status: USER_LIBRARY_LINKED_PIN_NUMBERS_CHECKED; Package: 0603; Footprint_status: LIBRARY_SELECTED_PENDING_LAYOUT_REVIEW; Value: 0
R50 R51 R53 R54 R56 R57 R70 = R: 电阻; MPN: 通用厚膜 1k 1% 0.1 W; Source_KiCad_Footprint: GL30:R_0603_1608Metric; Specification: 1k Ω；1%；0.1 W; Assembly: FITTED; PCB_Model_Status: USER_LIBRARY_LINKED_PIN_NUMBERS_CHECKED; Package: 0603; Footprint_status: LIBRARY_SELECTED_PENDING_LAYOUT_REVIEW; Value: 1k
R67 R68 = R: 电阻; MPN: RT0603BRD07100KL; Source_KiCad_Footprint: GL30:R_0603_1608Metric; Specification: 100k Ω；0.1%；0.1 W; Assembly: FITTED; PCB_Model_Status: USER_LIBRARY_LINKED_PIN_NUMBERS_CHECKED; Package: 0603; Footprint_status: LIBRARY_SELECTED_PENDING_LAYOUT_REVIEW; Value: 100k 0.1%
R69 = R: 电阻; MPN: TNPW060320K0BEEA; Source_KiCad_Footprint: GL30:R_0603_1608Metric; Specification: 20k Ω；0.1%；0.1 W; Assembly: FITTED; PCB_Model_Status: USER_LIBRARY_LINKED_PIN_NUMBERS_CHECKED; Package: 0603; Footprint_status: LIBRARY_SELECTED_PENDING_LAYOUT_REVIEW; Value: 20k 0.1%
U9 = TMUX1511PWR: 四路采样断电隔离; Source_KiCad_Footprint: GL30:TSSOP-14_4.4x5mm_P0.65mm; Design_note: 4路SEL均接3V3；断电保护信号≤3.6V；保持比较器支路直连; Assembly: FITTED; PCB_Model_Status: USER_LIBRARY_LINKED_PIN_NUMBERS_CHECKED; Datasheet: https://www.ti.com/lit/ds/symlink/tmux1511.pdf; MPN: TMUX1511PWR; Package: PW TSSOP14 5×4.4 mm; Specification: TMUX1511PWR; Footprint_status: LIBRARY_SELECTED_PENDING_LAYOUT_REVIEW; Value: TMUX1511PWR

## Sheet A04_HARD_PROTECT.SchDoc: A04_HARD_PROTECT
size 420 x 296 mm; Revision: A-SCH-AD-R2-NO-TP; SheetNumber: 4; SheetTotal: 7
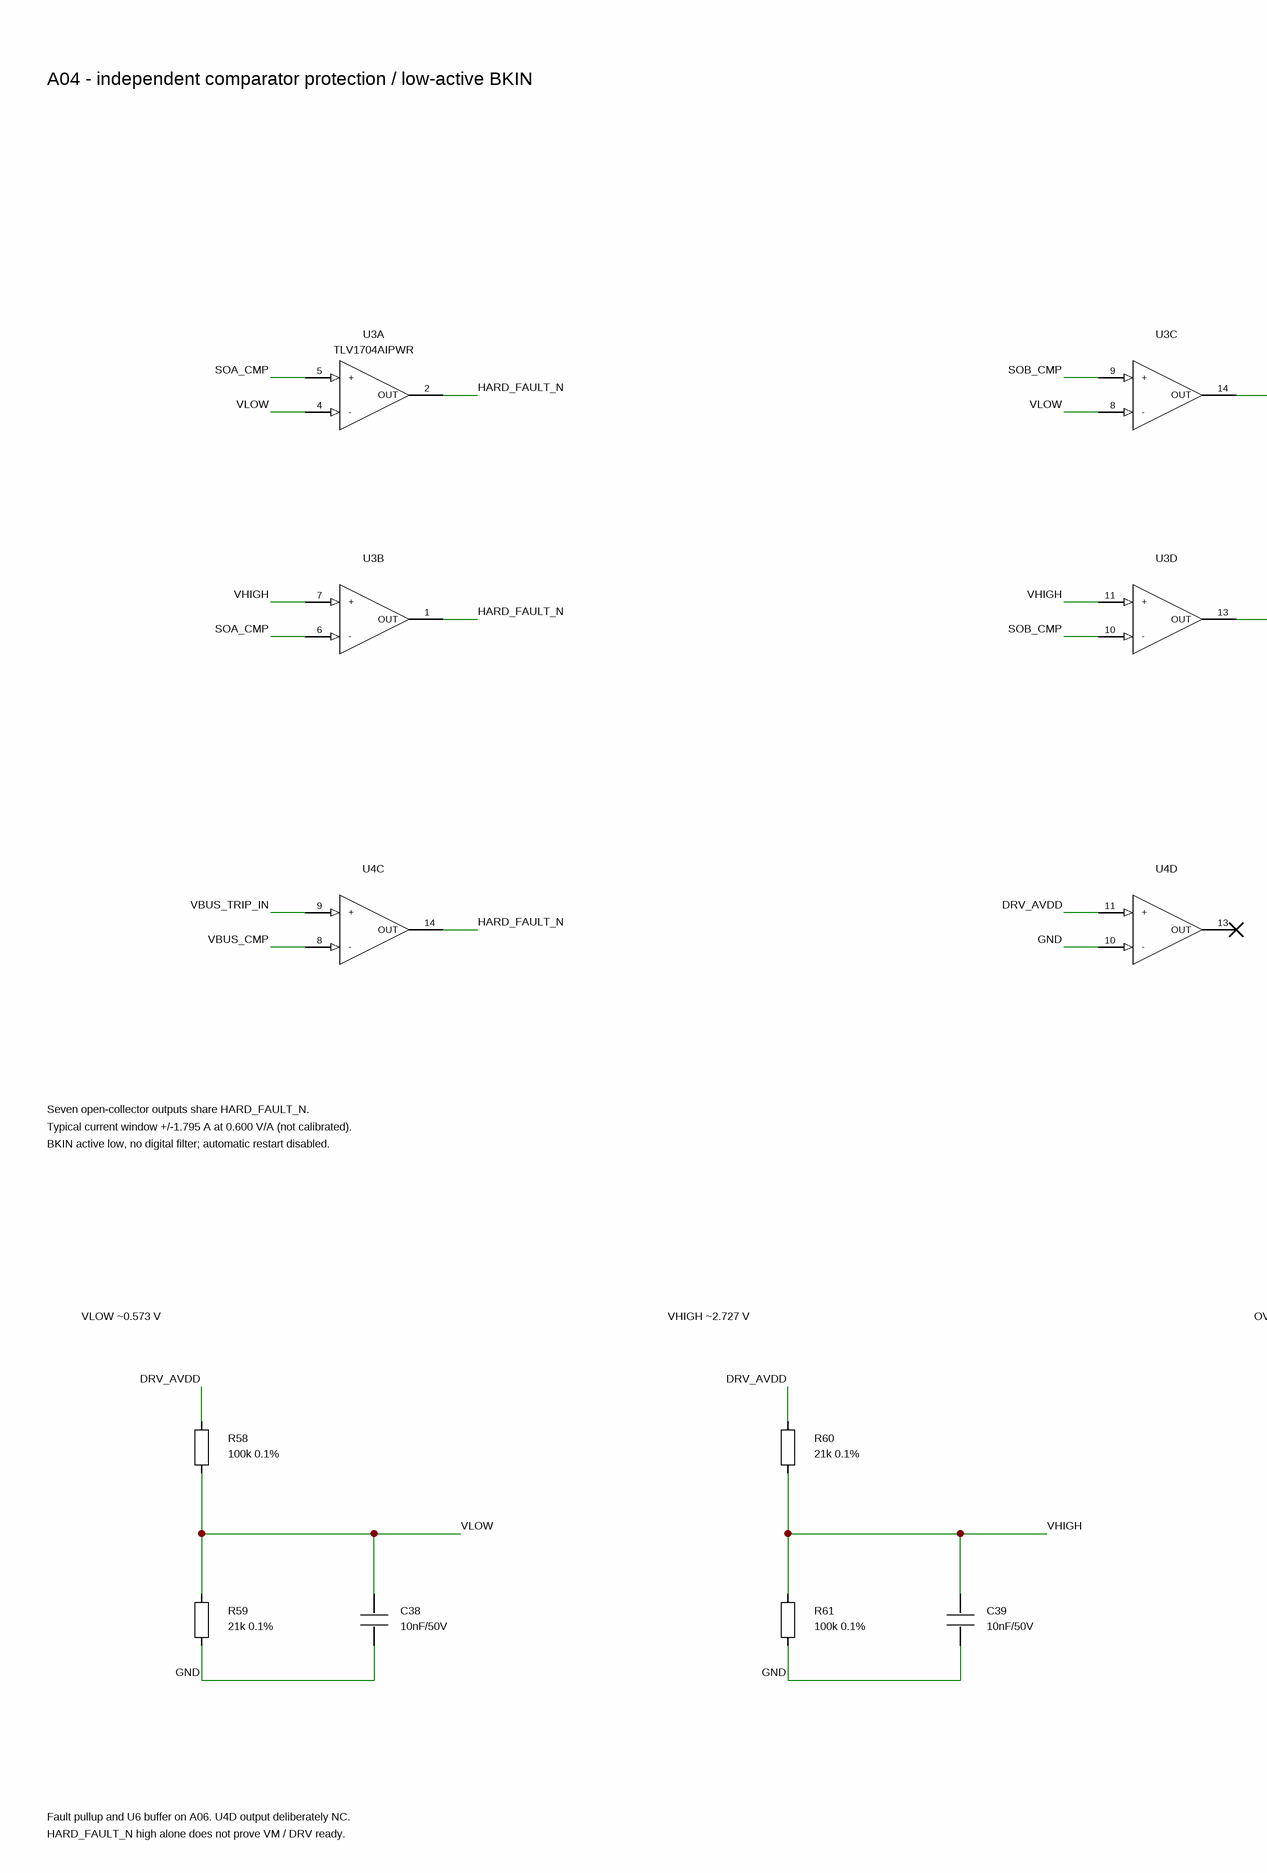
[diagram p6: A04_HARD_PROTECT.SchDoc, left]
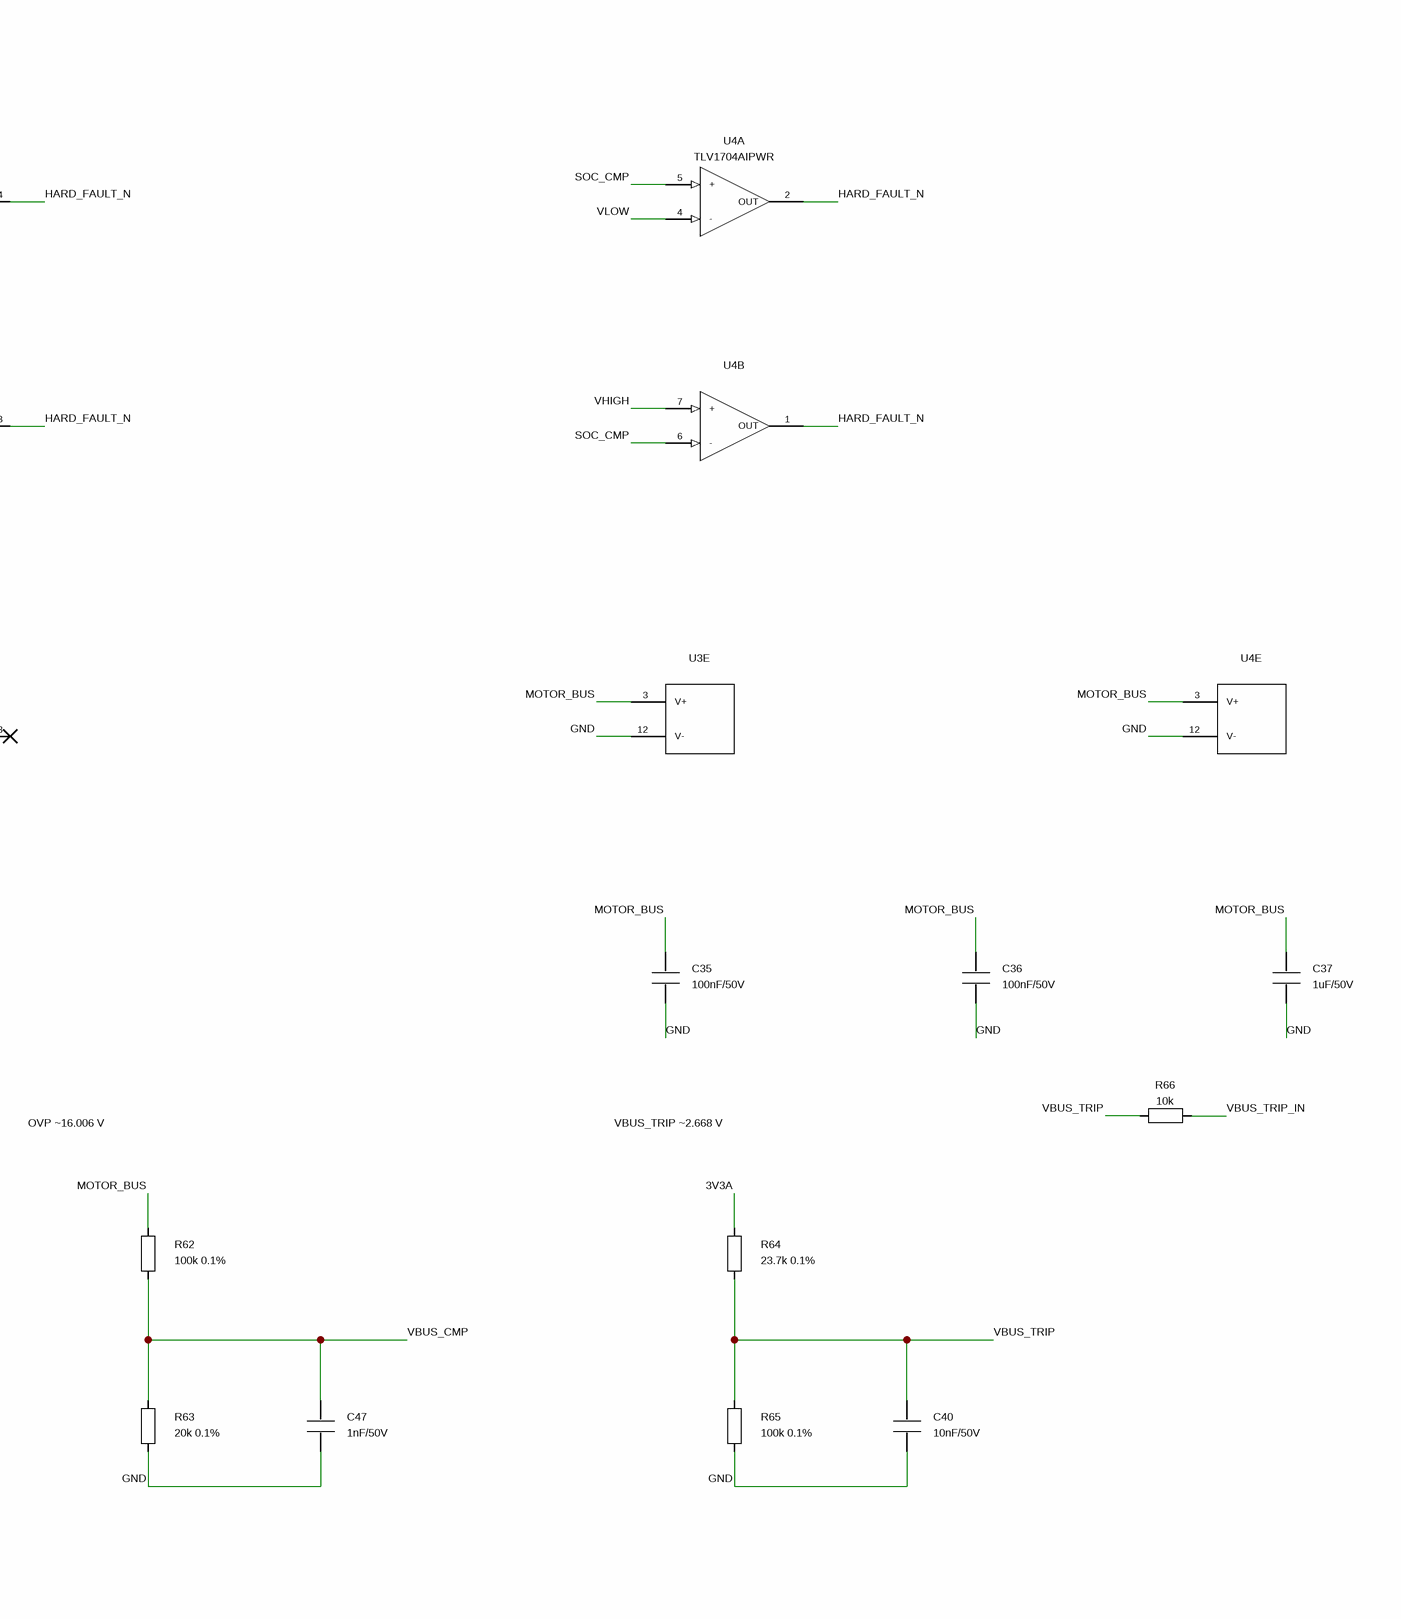
[diagram p7: A04_HARD_PROTECT.SchDoc, right]

### Parts
C35  100nF/50V  [C0603_M]
C36  100nF/50V  [C0603_M]
C37  1uF/50V  [C0805_M]
C38  10nF/50V  [C0603_M]
C39  10nF/50V  [C0603_M]
C40  10nF/50V  [C0603_M]
C47  1nF/50V  [C0603_M]
R58  100k 0.1%  [R0603_M]
R59  21k 0.1%  [R0603_M]
R60  21k 0.1%  [R0603_M]
R61  100k 0.1%  [R0603_M]
R62  100k 0.1%  [R0603_M]
R63  20k 0.1%  [R0603_M]
R64  23.7k 0.1%  [R0603_M]
R65  100k 0.1%  [R0603_M]
R66  10k  [R0603_M]
U3  TLV1704AIPWR  [C181596_TSSOP-14]  (parts A,B,C,D,E of 4)
U4  TLV1704AIPWR  [C181596_TSSOP-14]  (parts A,B,C,D,E of 4)

### Nets
3V3A: R64.1
DRV_AVDD: R58.1 R60.1 U4.11(+)
GND: C35.2 C36.2 C37.2 C38.2 C39.2 C40.2 C47.2 R59.2 R61.2 R63.2 R65.2 U3.12(V-) U4.10(-) U4.12(V-)
HARD_FAULT_N: U3.1(OUT) U3.2(OUT) U3.13(OUT) U3.14(OUT) U4.1(OUT) U4.2(OUT) U4.14(OUT)
MOTOR_BUS: C35.1 C36.1 C37.1 R62.1 U3.3(V+) U4.3(V+)
SOA_CMP: U3.5(+) U3.6(-)
SOB_CMP: U3.9(+) U3.10(-)
SOC_CMP: U4.5(+) U4.6(-)
VBUS_CMP: C47.1 R62.2 R63.1 U4.8(-)
VBUS_TRIP: C40.1 R64.2 R65.1 R66.1
VBUS_TRIP_IN: R66.2 U4.9(+)
VHIGH: C39.1 R60.2 R61.1 U3.7(+) U3.11(+) U4.7(+)
VLOW: C38.1 R58.2 R59.1 U3.4(-) U3.8(-) U4.4(-)

Not connected (* = marked no-connect by the designer): U4 13(OUT)*

### Notes on the sheet
- A04 - independent comparator protection / low-active BKIN
- Seven open-collector outputs share HARD_FAULT_N.
- Typical current window +/-1.795 A at 0.600 V/A (not calibrated).
- BKIN active low, no digital filter; automatic restart disabled.
- VLOW ~0.573 V
- VHIGH ~2.727 V
- OVP ~16.006 V
- VBUS_TRIP ~2.668 V
- Fault pullup and U6 buffer on A06. U4D output deliberately NC.
- HARD_FAULT_N high alone does not prove VM / DRV ready.

### Library data of the parts
C35 = C: 电容; MPN: CL10B104KB8NNNC; Source_KiCad_Footprint: GL30:C_0603_1608Metric; Specification: 100 nF / 50 V X7R; Design_note: U3供电; Assembly: FITTED; PCB_Model_Status: USER_LIBRARY_LINKED_PIN_NUMBERS_CHECKED; Package: 0603; Footprint_status: LIBRARY_SELECTED_PENDING_LAYOUT_REVIEW; Value: 100nF/50V
C36 = C: 电容; MPN: CL10B104KB8NNNC; Source_KiCad_Footprint: GL30:C_0603_1608Metric; Specification: 100 nF / 50 V X7R; Design_note: U4供电; Assembly: FITTED; PCB_Model_Status: USER_LIBRARY_LINKED_PIN_NUMBERS_CHECKED; Package: 0603; Footprint_status: LIBRARY_SELECTED_PENDING_LAYOUT_REVIEW; Value: 100nF/50V
C37 = C: 电容; MPN: CL21B105KBFNNNE; Source_KiCad_Footprint: GL30:C_0805_2012Metric; Specification: 1 µF / 50 V X7R; Design_note: 比较器就近共用; Assembly: FITTED; PCB_Model_Status: USER_LIBRARY_LINKED_PIN_NUMBERS_CHECKED; Package: 0805; Footprint_status: LIBRARY_SELECTED_PENDING_LAYOUT_REVIEW; Value: 1uF/50V
C38-C40 = C: 电容; MPN: CC0603KRX7R9BB103; Source_KiCad_Footprint: GL30:C_0603_1608Metric; Specification: 10 nF / 50 V X7R; Assembly: FITTED; PCB_Model_Status: USER_LIBRARY_LINKED_PIN_NUMBERS_CHECKED; Package: 0603; Footprint_status: LIBRARY_SELECTED_PENDING_LAYOUT_REVIEW; Value: 10nF/50V
C47 = C: as C48 on sheet A03_CURRENT_ADC; Package: 0603; Footprint_status: LIBRARY_SELECTED_PENDING_LAYOUT_REVIEW; Value: 1nF/50V
R58 R61 R62 R65 = R: as R67 on sheet A03_CURRENT_ADC; Package: 0603; Footprint_status: LIBRARY_SELECTED_PENDING_LAYOUT_REVIEW; Value: 100k 0.1%
R59 R60 = R: 电阻; MPN: PTFR0603B21K0N9; Source_KiCad_Footprint: GL30:R_0603_1608Metric; Specification: 21k Ω；0.1%；0.1 W; Assembly: FITTED; PCB_Model_Status: USER_LIBRARY_LINKED_PIN_NUMBERS_CHECKED; Package: 0603; Footprint_status: LIBRARY_SELECTED_PENDING_LAYOUT_REVIEW; Value: 21k 0.1%
R63 = R: as R69 on sheet A03_CURRENT_ADC; Package: 0603; Footprint_status: LIBRARY_SELECTED_PENDING_LAYOUT_REVIEW; Value: 20k 0.1%
R64 = R: 电阻; MPN: AT0603BRD0723K7L; Source_KiCad_Footprint: GL30:R_0603_1608Metric; Specification: 23.7k Ω；0.1%；0.1 W; Assembly: FITTED; PCB_Model_Status: USER_LIBRARY_LINKED_PIN_NUMBERS_CHECKED; Package: 0603; Footprint_status: LIBRARY_SELECTED_PENDING_LAYOUT_REVIEW; Value: 23.7k 0.1%
R66 = R: 电阻; MPN: 通用厚膜 10k 1% 0.1 W; Source_KiCad_Footprint: GL30:R_0603_1608Metric; Specification: 10k Ω；1%；0.1 W; Design_note: VM断电时限制TLV输入钳位电流；原理图不可省略; Assembly: FITTED; PCB_Model_Status: USER_LIBRARY_LINKED_PIN_NUMBERS_CHECKED; Package: 0603; Footprint_status: LIBRARY_SELECTED_PENDING_LAYOUT_REVIEW; Value: 10k
U3 = TLV1704AIPWR: 四路比较器; Source_KiCad_Footprint: GL30:TSSOP-14_4.4x5mm_P0.65mm; Assembly: FITTED; PCB_Model_Status: USER_LIBRARY_LINKED_PIN_NUMBERS_CHECKED; Datasheet: https://www.ti.com/lit/ds/symlink/tlv1704.pdf; MPN: TLV1704AIPWR; Package: PW TSSOP14 5×4.4 mm; Specification: TLV1704AIPWR; Footprint_status: LIBRARY_SELECTED_PENDING_LAYOUT_REVIEW; Value: TLV1704AIPWR
U4 = TLV1704AIPWR: 四路比较器; Source_KiCad_Footprint: GL30:TSSOP-14_4.4x5mm_P0.65mm; Design_note: 仅U4通道4未用：+接AVDD，−接GND，输出NC；U3四路全用; Assembly: FITTED; PCB_Model_Status: USER_LIBRARY_LINKED_PIN_NUMBERS_CHECKED; Datasheet: https://www.ti.com/lit/ds/symlink/tlv1704.pdf; MPN: TLV1704AIPWR; Package: PW TSSOP14 5×4.4 mm; Specification: TLV1704AIPWR; Footprint_status: LIBRARY_SELECTED_PENDING_LAYOUT_REVIEW; Value: TLV1704AIPWR

## Sheet A05_ENCODER_NTC.SchDoc: A05_ENCODER_NTC
size 420 x 296 mm; Revision: A-SCH-AD-R2-NO-TP; SheetNumber: 5; SheetTotal: 7
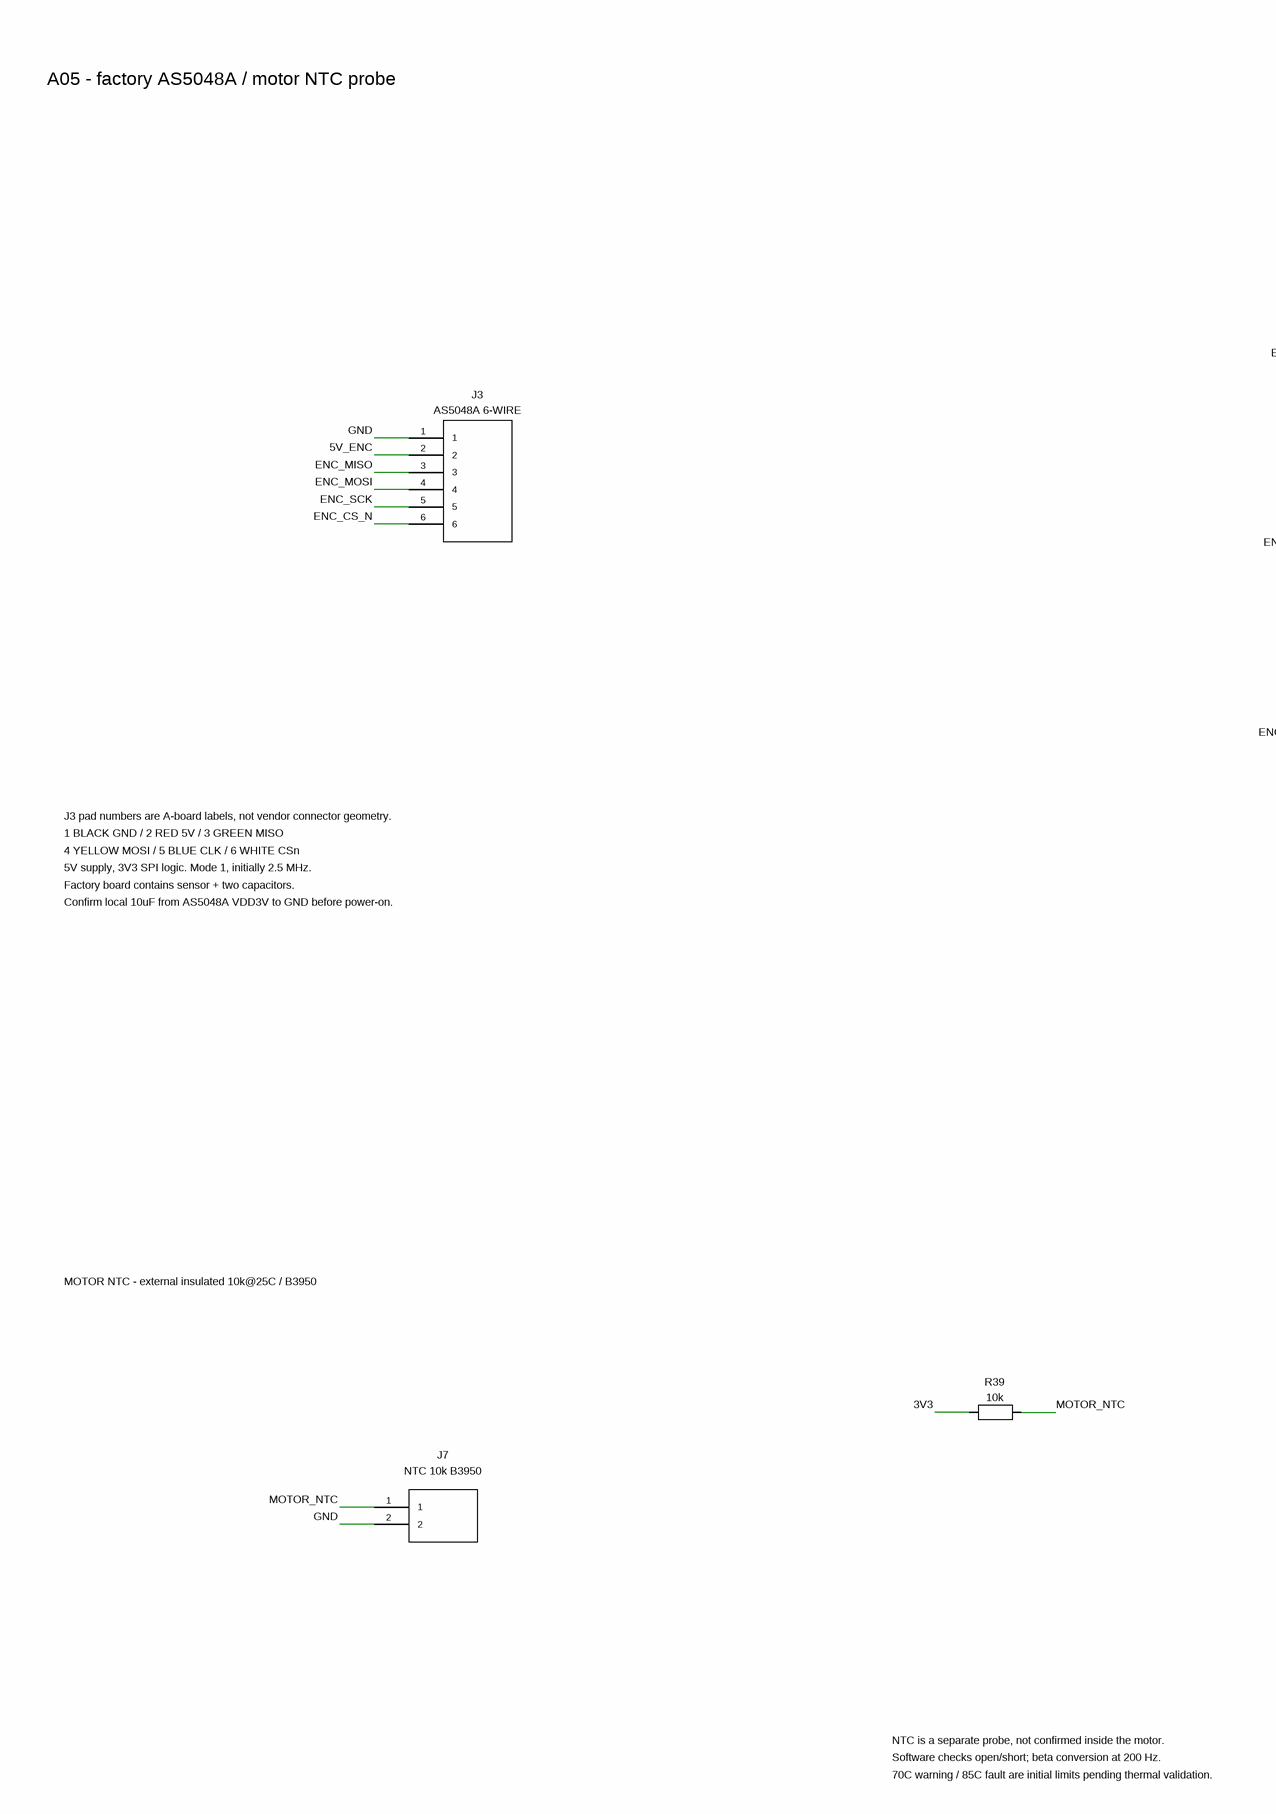
[diagram p8: A05_ENCODER_NTC.SchDoc, left]
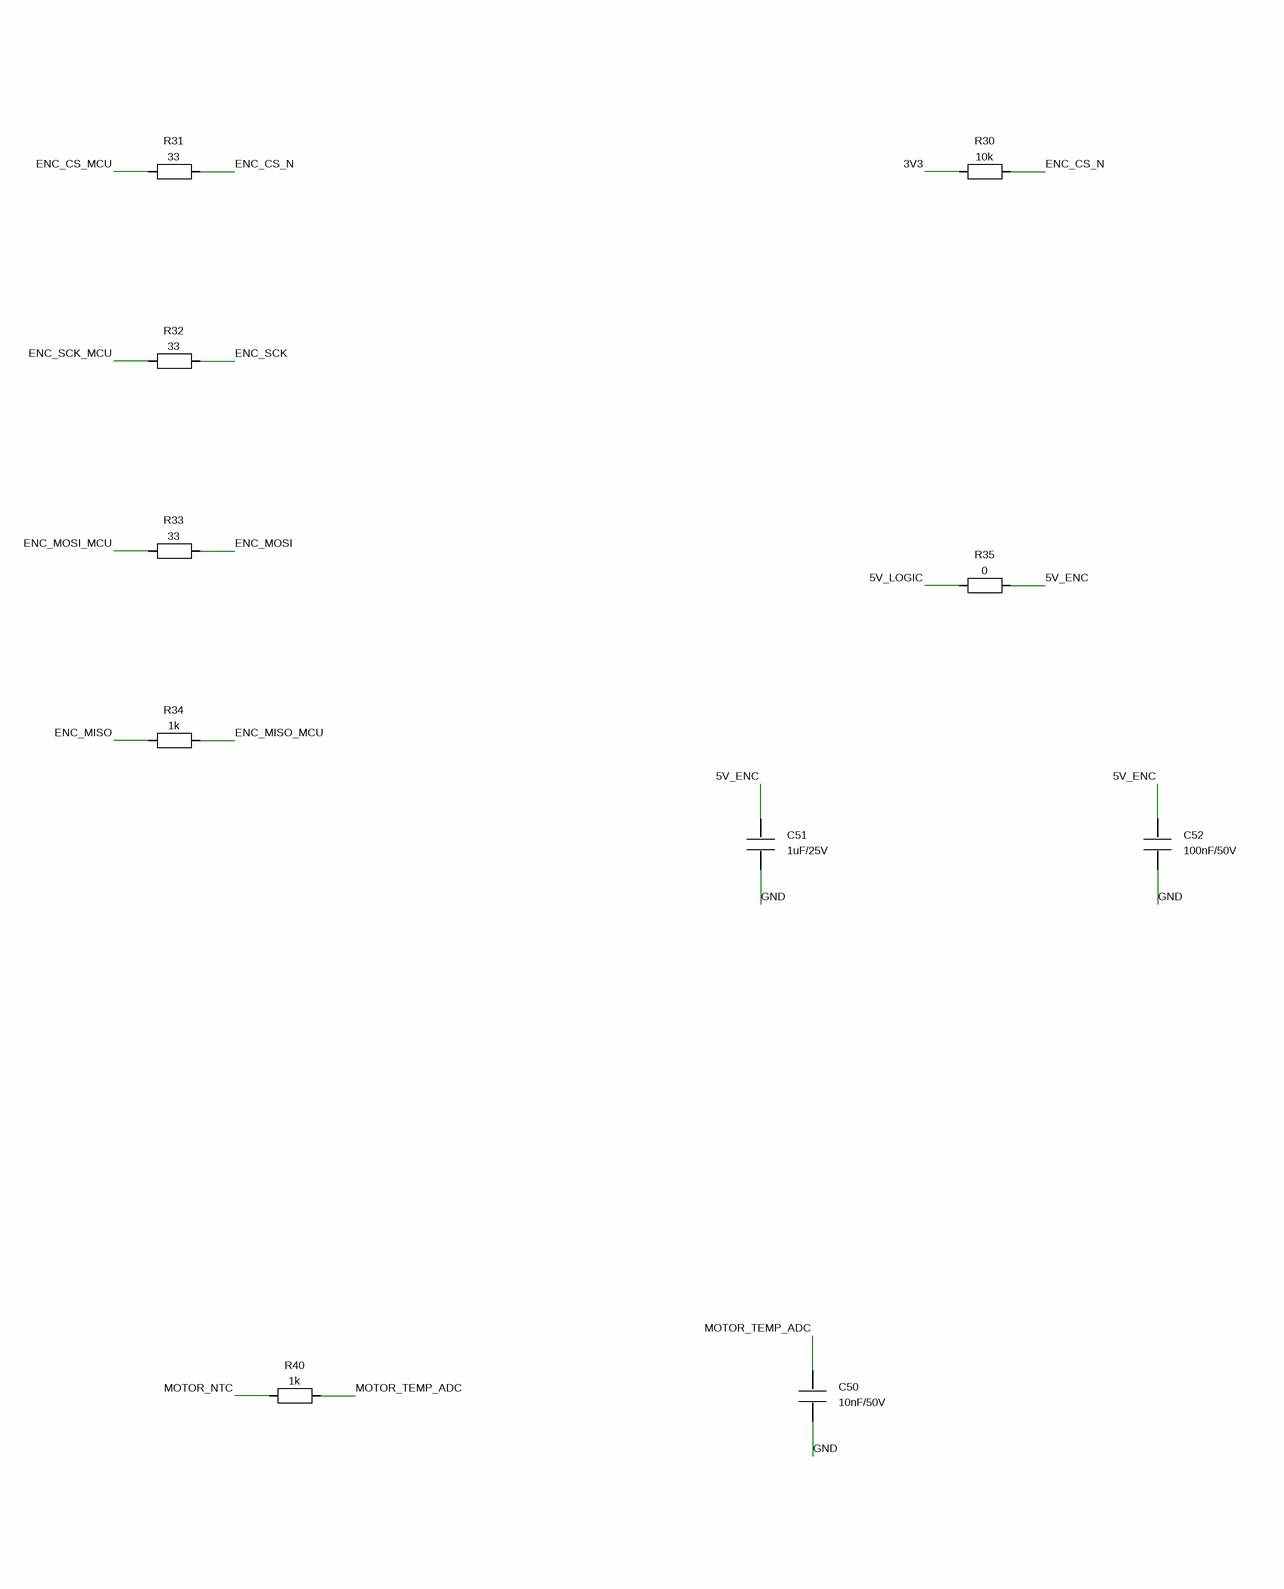
[diagram p9: A05_ENCODER_NTC.SchDoc, right]

### Parts
C50  10nF/50V  [C0603_M]
C51  1uF/25V  [C0603_M]
C52  100nF/50V  [C0603_M]
J3  AS5048A 6-WIRE
J7  NTC 10k B3950  [GL30_B2B_PH_K_S_FR4_D085]
R30  10k  [R0603_M]
R31  33  [R0603_M]
R32  33  [R0603_M]
R33  33  [R0603_M]
R34  1k  [R0603_M]
R35  0  [R0603_M]
R39  10k  [R0603_M]
R40  1k  [R0603_M]

### Nets
3V3: R30.1 R39.1
5V_ENC: C51.1 C52.1 J3.2 R35.2
5V_LOGIC: R35.1
ENC_CS_MCU: R31.1
ENC_CS_N: J3.6 R30.2 R31.2
ENC_MISO: J3.3 R34.1
ENC_MISO_MCU: R34.2
ENC_MOSI: J3.4 R33.2
ENC_MOSI_MCU: R33.1
ENC_SCK: J3.5 R32.2
ENC_SCK_MCU: R32.1
GND: C50.2 C51.2 C52.2 J3.1 J7.2
MOTOR_NTC: J7.1 R39.2 R40.1
MOTOR_TEMP_ADC: C50.1 R40.2

### Notes on the sheet
- A05 - factory AS5048A / motor NTC probe
- J3 pad numbers are A-board labels, not vendor connector geometry.
- 1 BLACK GND / 2 RED 5V / 3 GREEN MISO
- 4 YELLOW MOSI / 5 BLUE CLK / 6 WHITE CSn
- 5V supply, 3V3 SPI logic. Mode 1, initially 2.5 MHz.
- Factory board contains sensor + two capacitors.
- Confirm local 10uF from AS5048A VDD3V to GND before power-on.
- MOTOR NTC - external insulated 10k@25C / B3950
- NTC is a separate probe, not confirmed inside the motor.
- Software checks open/short; beta conversion at 200 Hz.
- 70C warning / 85C fault are initial limits pending thermal validation.

### Library data of the parts
C50 = C: as C38 on sheet A04_HARD_PROTECT; Package: 0603; Footprint_status: LIBRARY_SELECTED_PENDING_LAYOUT_REVIEW; Value: 10nF/50V
C51 = C: 电容; MPN: CL10A105KA8NNNC; Source_KiCad_Footprint: GL30:C_0603_1608Metric; Specification: 1 µF / 25 V X5R; Assembly: FITTED; PCB_Model_Status: USER_LIBRARY_LINKED_PIN_NUMBERS_CHECKED; Package: 0603; Footprint_status: LIBRARY_SELECTED_PENDING_LAYOUT_REVIEW; Value: 1uF/25V
C52 = C: as C1 on sheet A01_POWER_MCU; Package: 0603; Footprint_status: LIBRARY_SELECTED_PENDING_LAYOUT_REVIEW; Value: 100nF/50V
J3 = Connector_6: AS5048A编码器焊线口; MPN: 6标号焊盘；不假定原厂插头脚号; Design_note: 编号为本板定义；颜色不能代表未知插头从左到右位置; Assembly: DNP_OR_DIRECT_WIRE_PADS; PCB_Model_Status: NOT_ASSIGNED_IN_ALTIUM_SCHEMATIC_DELIVERY; Package: 6焊盘低电流焊线区; Specification: 6标号焊盘；不假定原厂插头脚号; Footprint_status: PENDING_PHYSICAL_FOOTPRINT_REVIEW; Value: AS5048A 6-WIRE
J7 = Connector_2: 电机温度探头; MPN: JST B2B-PH-K-S(LF)(SN); Source_KiCad_Footprint: GL30:JST_PH_B2B-PH-K_1x02_P2.00mm_Vertical; Design_note: 本版采用10k/B3950无源NTC；必须与电池NTC分开; Assembly: FITTED; PCB_Model_Status: USER_LIBRARY_LINKED_PIN_NUMBERS_CHECKED; Package: PH 2.0mm 2P 直插; Specification: JST B2B-PH-K-S(LF)(SN); Footprint_status: LIBRARY_SELECTED_PENDING_LAYOUT_REVIEW; Value: NTC 10k B3950
R30 = R: as R4 on sheet A01_POWER_MCU; Package: 0603; Footprint_status: LIBRARY_SELECTED_PENDING_LAYOUT_REVIEW; Value: 10k
R31-R33 = R: 电阻; MPN: 通用厚膜 33 1% 0.1 W; Source_KiCad_Footprint: GL30:R_0603_1608Metric; Specification: 33 Ω；1%；0.1 W; Assembly: FITTED; PCB_Model_Status: USER_LIBRARY_LINKED_PIN_NUMBERS_CHECKED; Package: 0603; Footprint_status: LIBRARY_SELECTED_PENDING_LAYOUT_REVIEW; Value: 33
R34 = R: 电阻; MPN: 通用厚膜 1k 1% 0.1 W; Source_KiCad_Footprint: GL30:R_0603_1608Metric; Specification: 1k Ω；1%；0.1 W; Design_note: MISO接收端限流；2.5MHz实测边沿，不当作源端终端; Assembly: FITTED; PCB_Model_Status: USER_LIBRARY_LINKED_PIN_NUMBERS_CHECKED; Package: 0603; Footprint_status: LIBRARY_SELECTED_PENDING_LAYOUT_REVIEW; Value: 1k
R35 = R: 电阻; MPN: 通用0Ω跳线 0.1 W; Source_KiCad_Footprint: GL30:R_0603_1608Metric; Specification: 0 Ω跳线；0.1 W; Design_note: 编码器电源支路可断开测流; Assembly: FITTED; PCB_Model_Status: USER_LIBRARY_LINKED_PIN_NUMBERS_CHECKED; Package: 0603; Footprint_status: LIBRARY_SELECTED_PENDING_LAYOUT_REVIEW; Value: 0
R39 = R: 电阻; MPN: 通用厚膜 10k 1% 0.1 W; Source_KiCad_Footprint: GL30:R_0603_1608Metric; Specification: 10k Ω；1%；0.1 W; Design_note: NTC上拉；NTC25℃=10k; Assembly: FITTED; PCB_Model_Status: USER_LIBRARY_LINKED_PIN_NUMBERS_CHECKED; Package: 0603; Footprint_status: LIBRARY_SELECTED_PENDING_LAYOUT_REVIEW; Value: 10k
R40 = R: as R50 on sheet A03_CURRENT_ADC; Package: 0603; Footprint_status: LIBRARY_SELECTED_PENDING_LAYOUT_REVIEW; Value: 1k

## Sheet A06_LINKS_POWER.SchDoc: A06_LINKS_POWER
size 420 x 296 mm; Revision: A-SCH-AD-R2-NO-TP; SheetNumber: 6; SheetTotal: 7
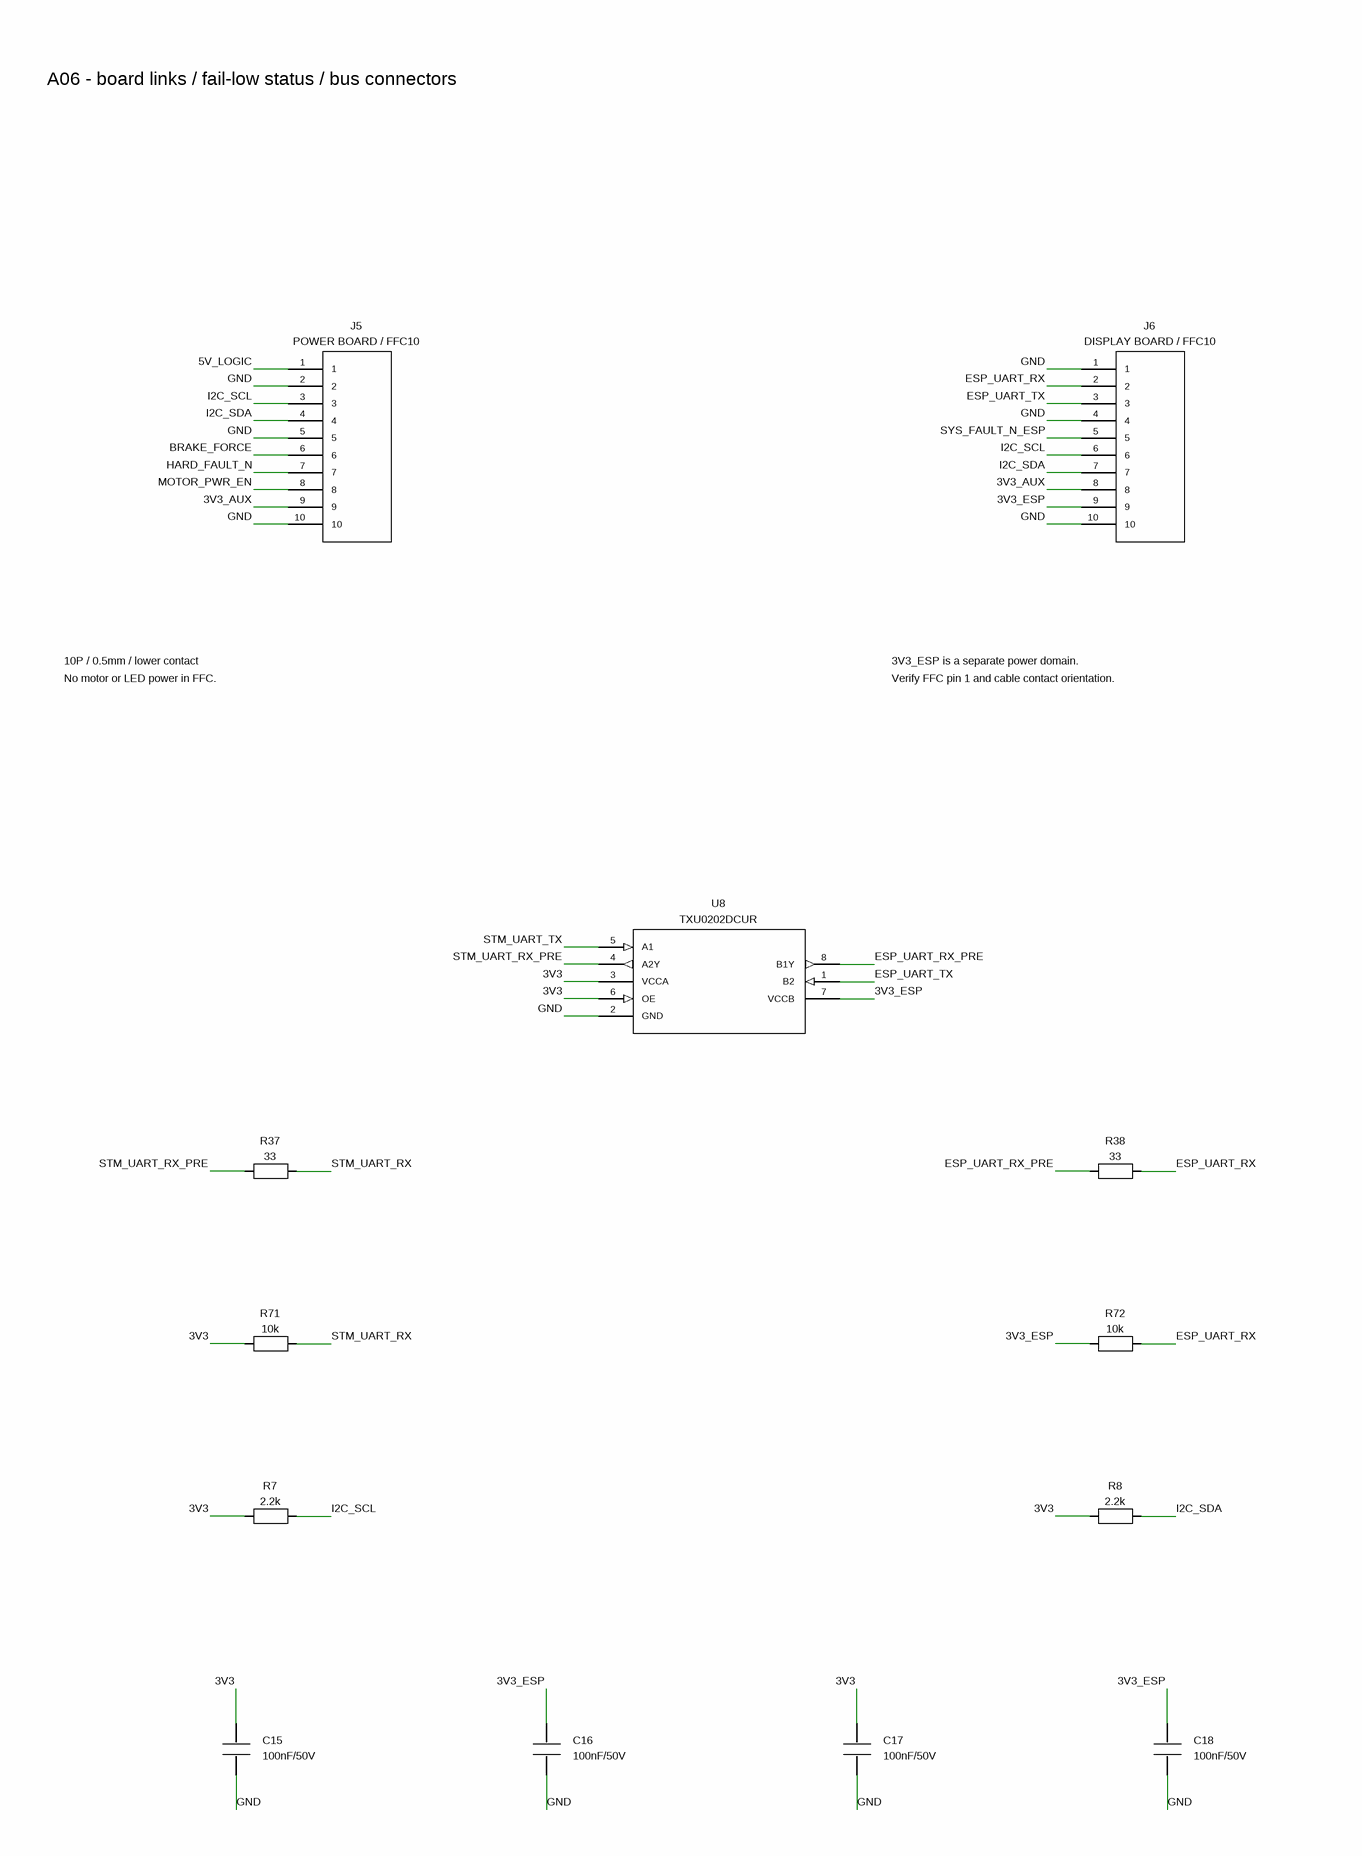
[diagram p10: A06_LINKS_POWER.SchDoc, left]
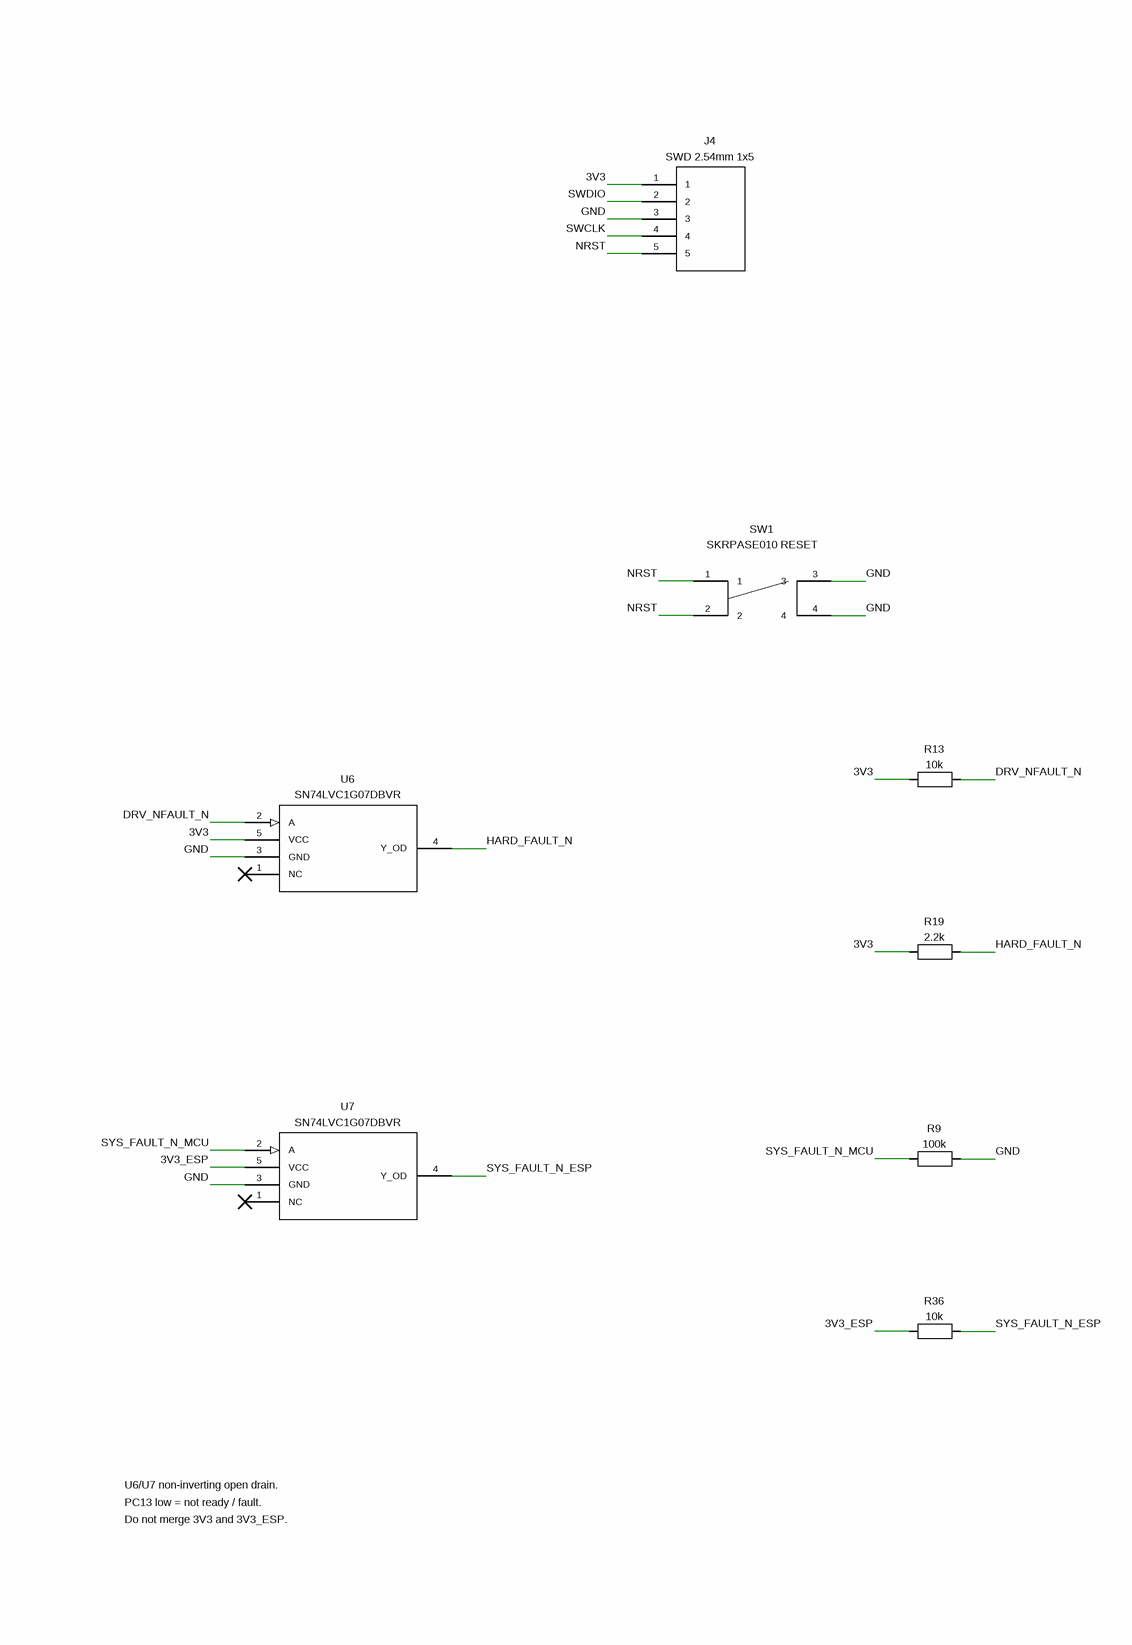
[diagram p11: A06_LINKS_POWER.SchDoc, right]

### Parts
C15  100nF/50V  [C0603_M]
C16  100nF/50V  [C0603_M]
C17  100nF/50V  [C0603_M]
C18  100nF/50V  [C0603_M]
J4  SWD 2.54mm 1x5  [GL30_HDR_1X05_P254_D102]
J5  POWER BOARD / FFC10  [FH1210S05SH55]
J6  DISPLAY BOARD / FFC10  [FH1210S05SH55]
R7  2.2k  [R0603_M]
R8  2.2k  [R0603_M]
R9  100k  [R0603_M]
R13  10k  [R0603_M]
R19  2.2k  [R0603_M]
R36  10k  [R0603_M]
R37  33  [R0603_M]
R38  33  [R0603_M]
R71  10k  [R0603_M]
R72  10k  [R0603_M]
SW1  SKRPASE010 RESET  [SKRPASE010]
U6  SN74LVC1G07DBVR  [SOT95P280X145-5N]
U7  SN74LVC1G07DBVR  [SOT95P280X145-5N]
U8  TXU0202DCUR  [SOP50P310X90-8N]

### Nets
3V3: C15.1 C17.1 J4.1 R7.1 R8.1 R13.1 R19.1 R71.1 U6.5(VCC) U8.3(VCCA) U8.6(OE)
3V3_AUX: J5.9 J6.8
3V3_ESP: C16.1 C18.1 J6.9 R36.1 R72.1 U7.5(VCC) U8.7(VCCB)
5V_LOGIC: J5.1
BRAKE_FORCE: J5.6
DRV_NFAULT_N: R13.2 U6.2(A)
ESP_UART_RX: J6.2 R38.2 R72.2
ESP_UART_RX_PRE: R38.1 U8.8(B1Y)
ESP_UART_TX: J6.3 U8.1(B2)
GND: C15.2 C16.2 C17.2 C18.2 J4.3 J5.2 J5.5 J5.10 J6.1 J6.4 J6.10 R9.2 SW1.3 SW1.4 U6.3(GND) U7.3(GND) U8.2(GND)
HARD_FAULT_N: J5.7 R19.2 U6.4(Y_OD)
I2C_SCL: J5.3 J6.6 R7.2
I2C_SDA: J5.4 J6.7 R8.2
MOTOR_PWR_EN: J5.8
NRST: J4.5 SW1.1 SW1.2
STM_UART_RX: R37.2 R71.2
STM_UART_RX_PRE: R37.1 U8.4(A2Y)
STM_UART_TX: U8.5(A1)
SWCLK: J4.4
SWDIO: J4.2
SYS_FAULT_N_ESP: J6.5 R36.2 U7.4(Y_OD)
SYS_FAULT_N_MCU: R9.1 U7.2(A)

Not connected (* = marked no-connect by the designer): U6 1(NC)*; U7 1(NC)*

### Notes on the sheet
- A06 - board links / fail-low status / bus connectors
- 10P / 0.5mm / lower contact
- 3V3_ESP is a separate power domain.
- No motor or LED power in FFC.
- Verify FFC pin 1 and cable contact orientation.
- U6/U7 non-inverting open drain.
- PC13 low = not ready / fault.
- Do not merge 3V3 and 3V3_ESP.

### Library data of the parts
C15 = C: 电容; MPN: CL10B104KB8NNNC; Source_KiCad_Footprint: GL30:C_0603_1608Metric; Specification: 100 nF / 50 V X7R; Design_note: U6; Assembly: FITTED; PCB_Model_Status: USER_LIBRARY_LINKED_PIN_NUMBERS_CHECKED; Package: 0603; Footprint_status: LIBRARY_SELECTED_PENDING_LAYOUT_REVIEW; Value: 100nF/50V
C16 = C: 电容; MPN: CL10B104KB8NNNC; Source_KiCad_Footprint: GL30:C_0603_1608Metric; Specification: 100 nF / 50 V X7R; Design_note: U7; Assembly: FITTED; PCB_Model_Status: USER_LIBRARY_LINKED_PIN_NUMBERS_CHECKED; Package: 0603; Footprint_status: LIBRARY_SELECTED_PENDING_LAYOUT_REVIEW; Value: 100nF/50V
C17 = C: 电容; MPN: CL10B104KB8NNNC; Source_KiCad_Footprint: GL30:C_0603_1608Metric; Specification: 100 nF / 50 V X7R; Design_note: U8.3; Assembly: FITTED; PCB_Model_Status: USER_LIBRARY_LINKED_PIN_NUMBERS_CHECKED; Package: 0603; Footprint_status: LIBRARY_SELECTED_PENDING_LAYOUT_REVIEW; Value: 100nF/50V
C18 = C: 电容; MPN: CL10B104KB8NNNC; Source_KiCad_Footprint: GL30:C_0603_1608Metric; Specification: 100 nF / 50 V X7R; Design_note: U8.7; Assembly: FITTED; PCB_Model_Status: USER_LIBRARY_LINKED_PIN_NUMBERS_CHECKED; Package: 0603; Footprint_status: LIBRARY_SELECTED_PENDING_LAYOUT_REVIEW; Value: 100nF/50V
J4 = Connector_5: SWD调试口; MPN: 通用单排排针 1×5P 2.54mm 直插; Design_note: 用户确认采用5P 2.54mm；1=VTREF(3V3), 2=SWDIO, 3=GND, 4=SWCLK, 5=NRST；VTREF仅供调试器感知目标电压，不作板供电输入; Assembly: FITTED; PCB_Model_Status: USER_LIBRARY_LINKED_PIN_NUMBERS_CHECKED; Package: THT 1×5，2.54mm；直插排针，0.64mm 方针; Specification: 通用单排排针 1×5P 2.54mm 直插; Footprint_status: REVIEWED_USER_LIBRARY_PROJECT_DERIVATIVE; Value: SWD 2.54mm 1x5
J5 = Connector_10: A↔B 电源板FFC; MPN: FH12-10S-0.5SH(55); Source_KiCad_Footprint: GL30:Hirose_FH12-10S-0.5SH_1x10-1MP_P0.50mm_Horizontal; Design_note: B板的充电/安全常开域独立供电；VM及主电流另走J1; Assembly: FITTED; PCB_Model_Status: USER_LIBRARY_LINKED_PIN_NUMBERS_CHECKED; Package: 10P 0.5mm SMT 下接触; Specification: FH12-10S-0.5SH(55); Footprint_status: LIBRARY_SELECTED_PENDING_LAYOUT_REVIEW; Value: POWER BOARD / FFC10
J6 = Connector_10: A↔C 屏幕与传感器FFC; MPN: FH12-10S-0.5SH(55); Source_KiCad_Footprint: GL30:Hirose_FH12-10S-0.5SH_1x10-1MP_P0.50mm_Horizontal; Design_note: 必须十线逐根导通核对；不是直接插屏幕12Pin；ESP自有5V/VSYS电源不经过此口; Assembly: FITTED; PCB_Model_Status: USER_LIBRARY_LINKED_PIN_NUMBERS_CHECKED; Package: 10P 0.5mm SMT 下接触; Specification: FH12-10S-0.5SH(55); Footprint_status: LIBRARY_SELECTED_PENDING_LAYOUT_REVIEW; Value: DISPLAY BOARD / FFC10
R7 R8 R19 = R: 电阻; MPN: 通用厚膜 2.2k 1% 0.1 W; Source_KiCad_Footprint: GL30:R_0603_1608Metric; Specification: 2.2k Ω；1%；0.1 W; Assembly: FITTED; PCB_Model_Status: USER_LIBRARY_LINKED_PIN_NUMBERS_CHECKED; Package: 0603; Footprint_status: LIBRARY_SELECTED_PENDING_LAYOUT_REVIEW; Value: 2.2k
R9 = R: as R5 on sheet A01_POWER_MCU; Package: 0603; Footprint_status: LIBRARY_SELECTED_PENDING_LAYOUT_REVIEW; Value: 100k
R13 = R: 电阻; MPN: 通用厚膜 10k 1% 0.1 W; Source_KiCad_Footprint: GL30:R_0603_1608Metric; Specification: 10k Ω；1%；0.1 W; Design_note: 独立上拉；逻辑5V/3V3先于VM上电; Assembly: FITTED; PCB_Model_Status: USER_LIBRARY_LINKED_PIN_NUMBERS_CHECKED; Package: 0603; Footprint_status: LIBRARY_SELECTED_PENDING_LAYOUT_REVIEW; Value: 10k
R36 = R: as R4 on sheet A01_POWER_MCU; Package: 0603; Footprint_status: LIBRARY_SELECTED_PENDING_LAYOUT_REVIEW; Value: 10k
R37 = R: 电阻; MPN: 通用厚膜 33 1% 0.1 W; Source_KiCad_Footprint: GL30:R_0603_1608Metric; Specification: 33 Ω；1%；0.1 W; Design_note: 放U8输出端; Assembly: FITTED; PCB_Model_Status: USER_LIBRARY_LINKED_PIN_NUMBERS_CHECKED; Package: 0603; Footprint_status: LIBRARY_SELECTED_PENDING_LAYOUT_REVIEW; Value: 33
R38 = R: 电阻; MPN: 通用厚膜 33 1% 0.1 W; Source_KiCad_Footprint: GL30:R_0603_1608Metric; Specification: 33 Ω；1%；0.1 W; Design_note: 放U8输出端，FFC到ESP RX; Assembly: FITTED; PCB_Model_Status: USER_LIBRARY_LINKED_PIN_NUMBERS_CHECKED; Package: 0603; Footprint_status: LIBRARY_SELECTED_PENDING_LAYOUT_REVIEW; Value: 33
R71 = R: 电阻; MPN: 通用厚膜 10k 1% 0.1 W; Source_KiCad_Footprint: GL30:R_0603_1608Metric; Specification: 10k Ω；1%；0.1 W; Design_note: U8掉电高阻时UART接收保持空闲高; Assembly: FITTED; PCB_Model_Status: USER_LIBRARY_LINKED_PIN_NUMBERS_CHECKED; Package: 0603; Footprint_status: LIBRARY_SELECTED_PENDING_LAYOUT_REVIEW; Value: 10k
R72 = R: 电阻; MPN: 通用厚膜 10k 1% 0.1 W; Source_KiCad_Footprint: GL30:R_0603_1608Metric; Specification: 10k Ω；1%；0.1 W; Design_note: STM掉电时ESP接收保持空闲高; Assembly: FITTED; PCB_Model_Status: USER_LIBRARY_LINKED_PIN_NUMBERS_CHECKED; Package: 0603; Footprint_status: LIBRARY_SELECTED_PENDING_LAYOUT_REVIEW; Value: 10k
SW1 = SKRPASE010: 复位按键; Specification: 常开瞬时; Design_note: 原厂编号1/2内部常连→NRST，3/4内部常连→GND；不改外壳按钮; Assembly: FITTED; PCB_Model_Status: USER_LIBRARY_LINKED_PIN_NUMBERS_CHECKED; MPN: SKRPASE010; Package: SMD 4.2×3.2×2.5 mm; Footprint_status: PENDING_PHYSICAL_FOOTPRINT_REVIEW; Value: SKRPASE010 RESET
U6 = SN74LVC1G07DBVR: DRV故障开漏缓冲; Source_KiCad_Footprint: GL30:SOT-23-5; Design_note: 防止比较器反拉DRV物理nFAULT; Assembly: FITTED; PCB_Model_Status: USER_LIBRARY_LINKED_PIN_NUMBERS_CHECKED; Datasheet: https://www.ti.com/lit/ds/symlink/sn74lvc1g07.pdf; MPN: SN74LVC1G07DBVR; Package: DBV SOT-23-5; Specification: SN74LVC1G07DBVR; Footprint_status: LIBRARY_SELECTED_PENDING_LAYOUT_REVIEW; Value: SN74LVC1G07DBVR
U7 = SN74LVC1G07DBVR: ESP故障开漏缓冲; Source_KiCad_Footprint: GL30:SOT-23-5; Design_note: 由ESP域供电；输入100k下拉；STM失电时报告故障; Assembly: FITTED; PCB_Model_Status: USER_LIBRARY_LINKED_PIN_NUMBERS_CHECKED; Datasheet: https://www.ti.com/lit/ds/symlink/sn74lvc1g07.pdf; MPN: SN74LVC1G07DBVR; Package: DBV SOT-23-5; Specification: SN74LVC1G07DBVR; Footprint_status: LIBRARY_SELECTED_PENDING_LAYOUT_REVIEW; Value: SN74LVC1G07DBVR
U8 = TXU0202DCUR: UART双电源接口; Source_KiCad_Footprint: GL30:VSSOP-8_2.3x2mm_P0.5mm; Design_note: 一发一收固定方向；不是TXB0102；OE接3V3; Assembly: FITTED; PCB_Model_Status: USER_LIBRARY_LINKED_PIN_NUMBERS_CHECKED; Datasheet: https://www.ti.com/lit/ds/symlink/txu0202.pdf; MPN: TXU0202DCUR; Package: DCU VSSOP8 2.3×2.0 mm; Specification: TXU0202DCUR; Footprint_status: LIBRARY_SELECTED_PENDING_LAYOUT_REVIEW; Value: TXU0202DCUR

## Sheet A07_BUS_CONTROL.SchDoc: A07_BUS_CONTROL
size 420 x 296 mm; Revision: A-SCH-AD-R2-NO-TP; SheetNumber: 7; SheetTotal: 7
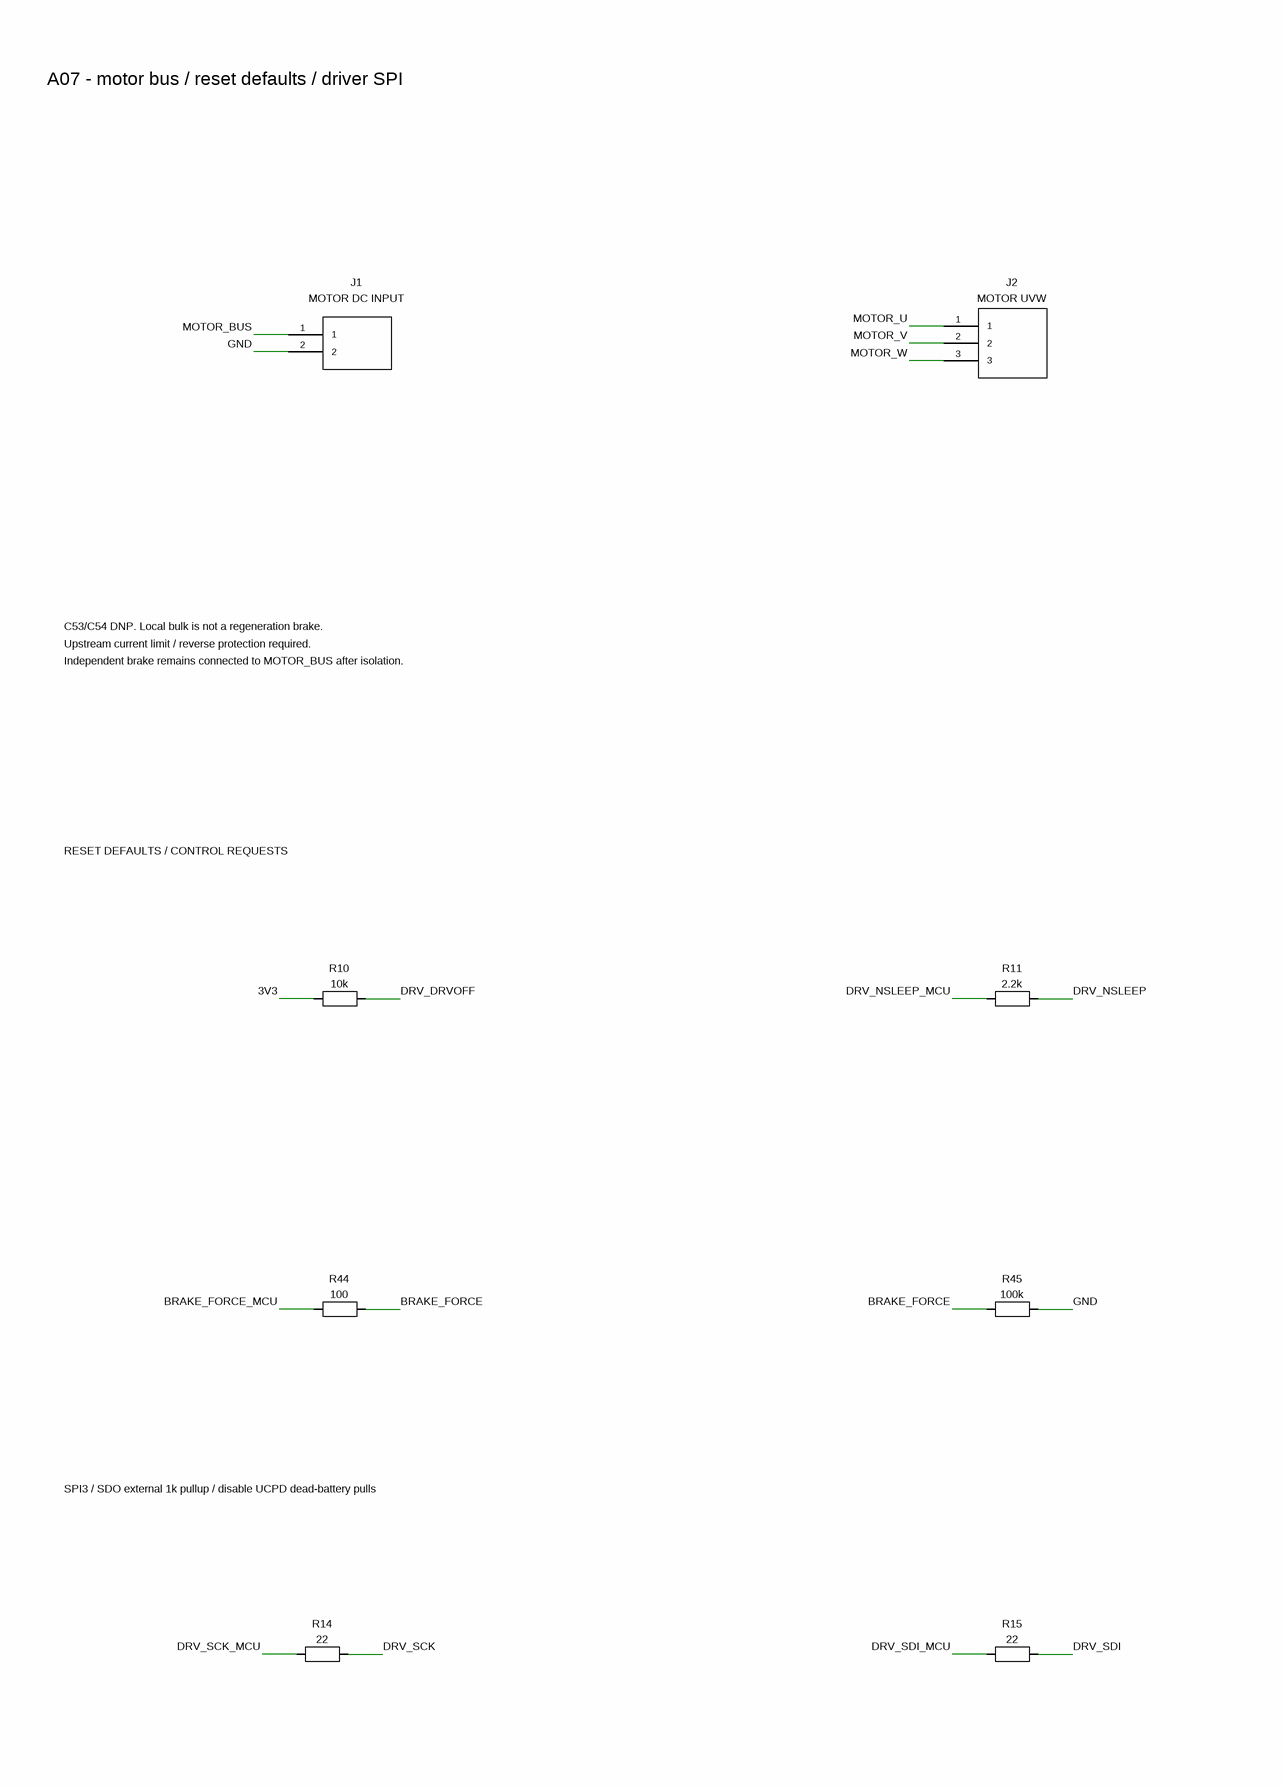
[diagram p12: A07_BUS_CONTROL.SchDoc, left]
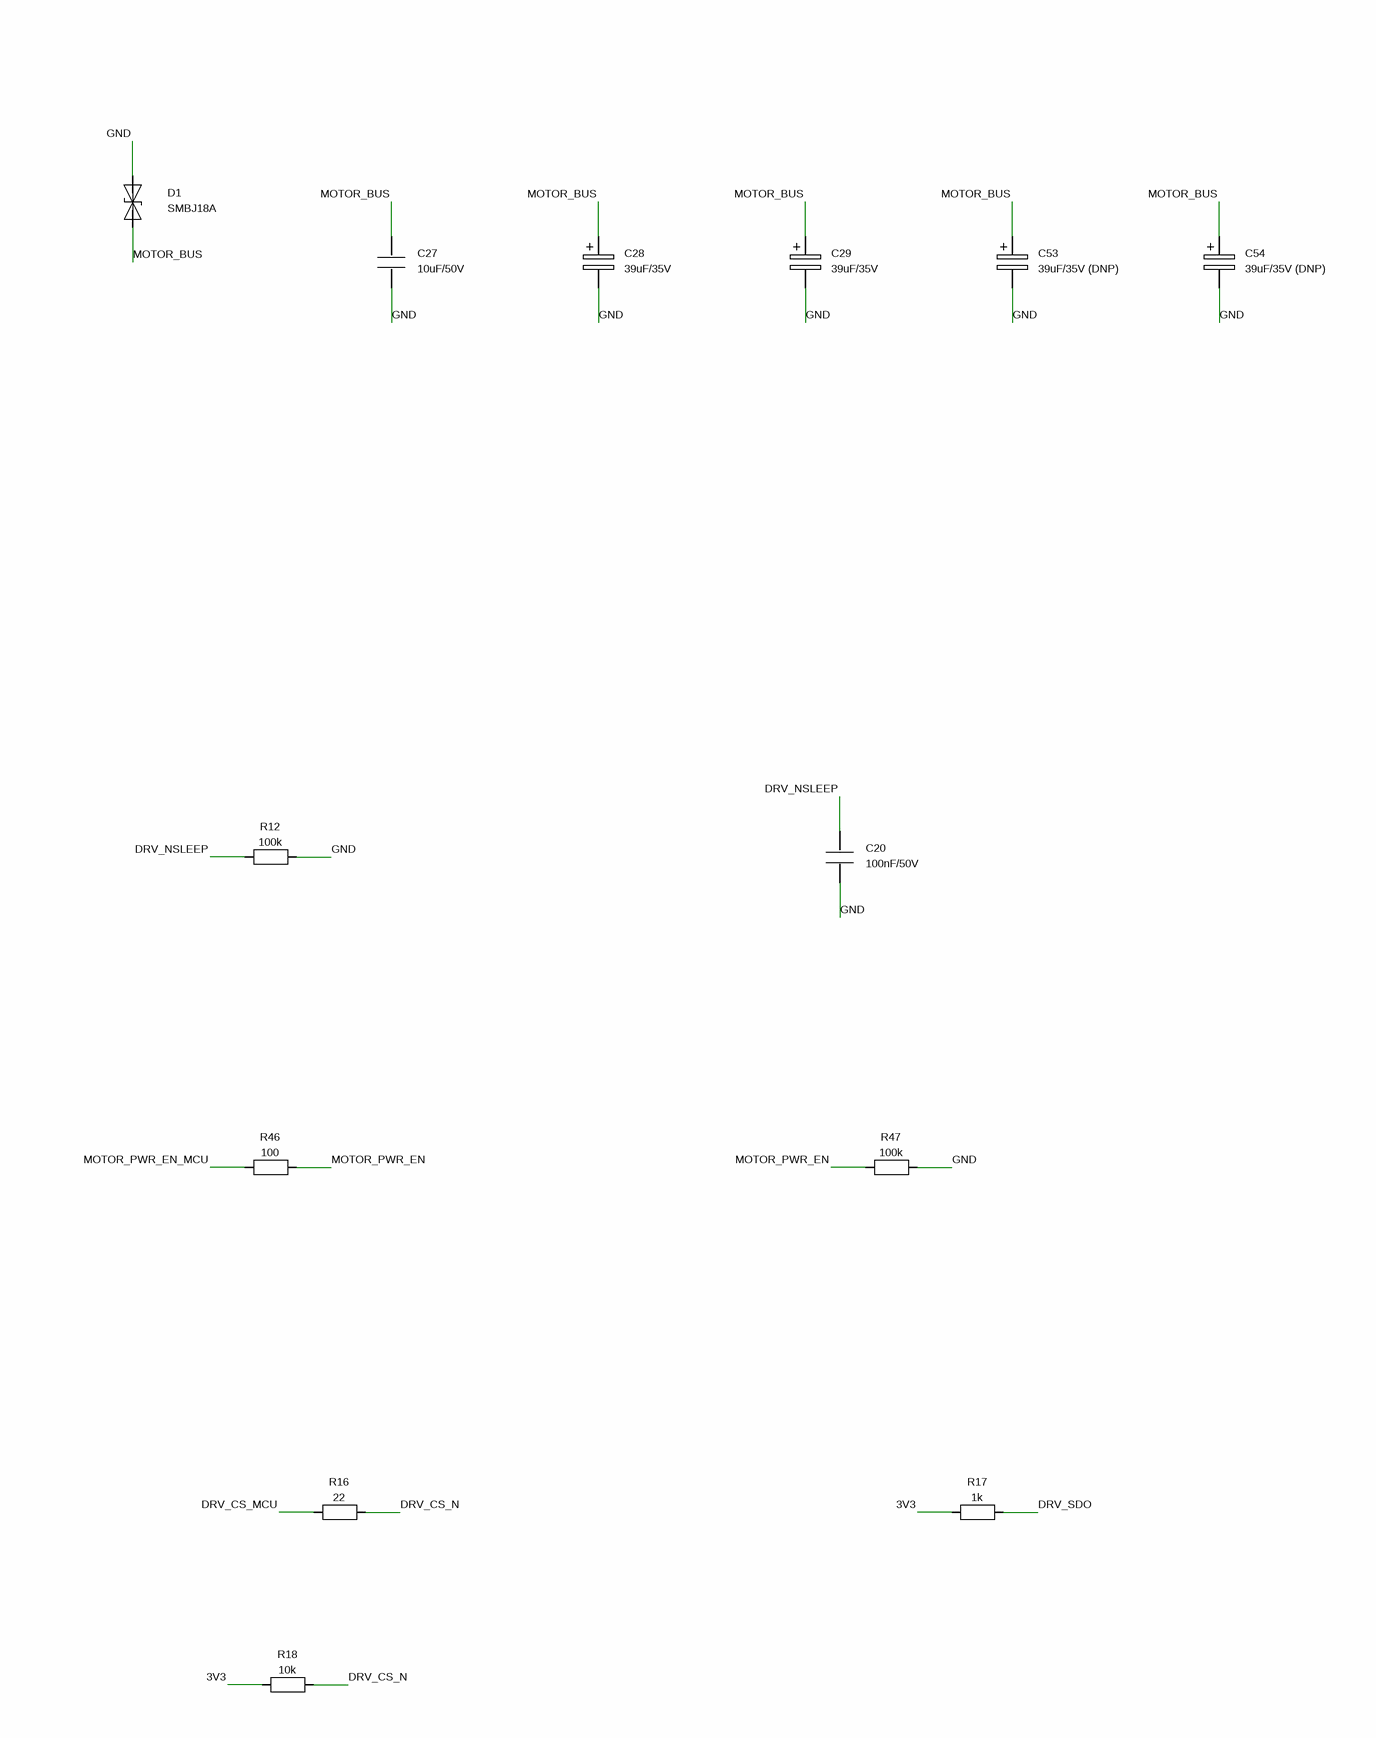
[diagram p13: A07_BUS_CONTROL.SchDoc, right]

### Parts
C20  100nF/50V  [C0603_M]
C27  10uF/50V  [CAPC3225X270N]
C28  39uF/35V  [16SVF270M]
C29  39uF/35V  [16SVF270M]
C53  39uF/35V (DNP)  [16SVF270M]
C54  39uF/35V (DNP)  [16SVF270M]
D1  SMBJ18A  [C151256_DO-214AA]
J1  MOTOR DC INPUT
J2  MOTOR UVW
R10  10k  [R0603_M]
R11  2.2k  [R0603_M]
R12  100k  [R0603_M]
R14  22  [R0603_M]
R15  22  [R0603_M]
R16  22  [R0603_M]
R17  1k  [R0603_M]
R18  10k  [R0603_M]
R44  100  [R0603_M]
R45  100k  [R0603_M]
R46  100  [R0603_M]
R47  100k  [R0603_M]

### Nets
3V3: R10.1 R17.1 R18.1
BRAKE_FORCE: R44.2 R45.1
BRAKE_FORCE_MCU: R44.1
DRV_CS_MCU: R16.1
DRV_CS_N: R16.2 R18.2
DRV_DRVOFF: R10.2
DRV_NSLEEP: C20.1 R11.2 R12.1
DRV_NSLEEP_MCU: R11.1
DRV_SCK: R14.2
DRV_SCK_MCU: R14.1
DRV_SDI: R15.2
DRV_SDI_MCU: R15.1
DRV_SDO: R17.2
GND: C20.2 C27.2 C28.2 C29.2 C53.2 C54.2 D1.2(A2) J1.2 R12.2 R45.2 R47.2
MOTOR_BUS: C27.1 C28.1 C29.1 C53.1 C54.1 D1.1(A1) J1.1
MOTOR_PWR_EN: R46.2 R47.1
MOTOR_PWR_EN_MCU: R46.1
MOTOR_U: J2.1
MOTOR_V: J2.2
MOTOR_W: J2.3

### Notes on the sheet
- A07 - motor bus / reset defaults / driver SPI
- C53/C54 DNP. Local bulk is not a regeneration brake.
- Upstream current limit / reverse protection required.
- Independent brake remains connected to MOTOR_BUS after isolation.
- RESET DEFAULTS / CONTROL REQUESTS
- SPI3 / SDO external 1k pullup / disable UCPD dead-battery pulls

### Library data of the parts
C20 = C: 电容; MPN: CL10B104KB8NNNC; Source_KiCad_Footprint: GL30:C_0603_1608Metric; Specification: 100 nF / 50 V X7R; Design_note: PA12驱动；只作开关机，快速故障复位优先CLR_FLT; Assembly: FITTED; PCB_Model_Status: USER_LIBRARY_LINKED_PIN_NUMBERS_CHECKED; Package: 0603; Footprint_status: LIBRARY_SELECTED_PENDING_LAYOUT_REVIEW; Value: 100nF/50V
C27 = C: 电容; MPN: GRM32ER71H106KA12L; Source_KiCad_Footprint: GL30:C_1210_3225Metric; Specification: 10 µF / 50 V X7R; Design_note: 陶瓷局部储能，核对直流偏压后有效容量; Assembly: FITTED; PCB_Model_Status: USER_LIBRARY_LINKED_PIN_NUMBERS_CHECKED; Package: 1210; Footprint_status: LIBRARY_SELECTED_PENDING_LAYOUT_REVIEW; Value: 10uF/50V
C28 = C_Polarized: 电容; MPN: 35SVPF39M; Specification: 39 µF / 35 V 聚合物 ±20%; Design_note: 有极性，+接VM；2颗共78µF，不承担连续再生; Assembly: FITTED; PCB_Model_Status: USER_LIBRARY_LINKED_PIN_NUMBERS_CHECKED; Package: SMD φ8 × 6.9 mm / E7; Footprint_status: PENDING_PHYSICAL_FOOTPRINT_REVIEW; Value: 39uF/35V
C29 = C_Polarized: 电容; MPN: 35SVPF39M; Specification: 39 µF / 35 V 聚合物 ±20%; Design_note: 有极性，+接VM；φ8×6.9mm需在R11内部校核; Assembly: FITTED; PCB_Model_Status: USER_LIBRARY_LINKED_PIN_NUMBERS_CHECKED; Package: SMD φ8 × 6.9 mm / E7; Footprint_status: PENDING_PHYSICAL_FOOTPRINT_REVIEW; Value: 39uF/35V
C53 C54 = C_Polarized: 电容; MPN: 35SVPF39M; Specification: 39 µF / 35 V 聚合物 ±20%; Design_note: 可选增容位置；若空间不足可不保留，不作为装机采购; Assembly: DNP_OR_DIRECT_WIRE_PADS; PCB_Model_Status: USER_LIBRARY_LINKED_PIN_NUMBERS_CHECKED; Package: SMD φ8 × 6.9 mm / E7; Footprint_status: PENDING_PHYSICAL_FOOTPRINT_REVIEW; Value: 39uF/35V
D1 = D_TVS: 母线瞬态TVS; Source_KiCad_Footprint: GL30:D_SMB; Specification: 单向；VRWM18 V; Design_note: 上游必须有限流/熔断；TVS只抑制尖峰，不能吸收连续反拖; Assembly: FITTED; PCB_Model_Status: USER_LIBRARY_LINKED_PIN_NUMBERS_CHECKED; MPN: SMBJ18A; Package: SMB / DO-214AA; Footprint_status: LIBRARY_SELECTED_PENDING_LAYOUT_REVIEW; Value: SMBJ18A
J1 = Connector_2: 电机母线焊线口; MPN: 2大焊盘+线束应力释放; Design_note: 通过短20–22AWG导线接XT30；上游B板保护与自动制动同接此母线; Assembly: DNP_OR_DIRECT_WIRE_PADS; PCB_Model_Status: NOT_ASSIGNED_IN_ALTIUM_SCHEMATIC_DELIVERY; Package: 2个焊线通孔；布局时按实线定孔径; Specification: 2大焊盘+线束应力释放; Footprint_status: PENDING_PHYSICAL_FOOTPRINT_REVIEW; Value: MOTOR DC INPUT
J2 = Connector_3: 电机三相焊线口; MPN: 3大焊盘+线束应力释放; Design_note: 沿用电机原线；三相顺序在新电机标定中确认；不重复买接插件; Assembly: DNP_OR_DIRECT_WIRE_PADS; PCB_Model_Status: NOT_ASSIGNED_IN_ALTIUM_SCHEMATIC_DELIVERY; Package: 3个焊线通孔；布局时按实线定孔径; Specification: 3大焊盘+线束应力释放; Footprint_status: PENDING_PHYSICAL_FOOTPRINT_REVIEW; Value: MOTOR UVW
R10 = R: 电阻; MPN: 通用厚膜 10k 1% 0.1 W; Source_KiCad_Footprint: GL30:R_0603_1608Metric; Specification: 10k Ω；1%；0.1 W; Design_note: 不可改100k；PA3开漏; Assembly: FITTED; PCB_Model_Status: USER_LIBRARY_LINKED_PIN_NUMBERS_CHECKED; Package: 0603; Footprint_status: LIBRARY_SELECTED_PENDING_LAYOUT_REVIEW; Value: 10k
R11 = R: as R7 on sheet A06_LINKS_POWER; Package: 0603; Footprint_status: LIBRARY_SELECTED_PENDING_LAYOUT_REVIEW; Value: 2.2k
R12 R45 R47 = R: as R5 on sheet A01_POWER_MCU; Package: 0603; Footprint_status: LIBRARY_SELECTED_PENDING_LAYOUT_REVIEW; Value: 100k
R14-R16 = R: 电阻; MPN: 通用厚膜 22 1% 0.1 W; Source_KiCad_Footprint: GL30:R_0603_1608Metric; Specification: 22 Ω；1%；0.1 W; Assembly: FITTED; PCB_Model_Status: USER_LIBRARY_LINKED_PIN_NUMBERS_CHECKED; Package: 0603; Footprint_status: LIBRARY_SELECTED_PENDING_LAYOUT_REVIEW; Value: 22
R17 = R: 电阻; MPN: 通用厚膜 1k 1% 0.1 W; Source_KiCad_Footprint: GL30:R_0603_1608Metric; Specification: 1k Ω；1%；0.1 W; Design_note: TI要求SDO外部上拉；同时禁用UCPD下拉; Assembly: FITTED; PCB_Model_Status: USER_LIBRARY_LINKED_PIN_NUMBERS_CHECKED; Package: 0603; Footprint_status: LIBRARY_SELECTED_PENDING_LAYOUT_REVIEW; Value: 1k
R18 = R: as R4 on sheet A01_POWER_MCU; Package: 0603; Footprint_status: LIBRARY_SELECTED_PENDING_LAYOUT_REVIEW; Value: 10k
R44 R46 = R: 电阻; MPN: 通用厚膜 100 1% 0.1 W; Source_KiCad_Footprint: GL30:R_0603_1608Metric; Specification: 100 Ω；1%；0.1 W; Assembly: FITTED; PCB_Model_Status: USER_LIBRARY_LINKED_PIN_NUMBERS_CHECKED; Package: 0603; Footprint_status: LIBRARY_SELECTED_PENDING_LAYOUT_REVIEW; Value: 100

## Nets that join several sheets
3V3: A01_POWER_MCU (14 pins), A03_CURRENT_ADC (6 pins), A05_ENCODER_NTC (R30.1 R39.1), A06_LINKS_POWER (11 pins), A07_BUS_CONTROL (R10.1 R17.1 R18.1)
3V3_AUX: A01_POWER_MCU (R3.2), A06_LINKS_POWER (J5.9 J6.8)
3V3A: A01_POWER_MCU (7 pins), A04_HARD_PROTECT (R64.1)
5V_LOGIC: A01_POWER_MCU (C13.1 U5.1 U5.3), A05_ENCODER_NTC (R35.1), A06_LINKS_POWER (J5.1)
BRAKE_FORCE: A06_LINKS_POWER (J5.6), A07_BUS_CONTROL (R44.2 R45.1)
BRAKE_FORCE_MCU: A01_POWER_MCU (U1.10), A07_BUS_CONTROL (R44.1)
DRV_AVDD: A02_DRV8316 (C32.1 R48.1 U2.25), A04_HARD_PROTECT (R58.1 R60.1 U4.11)
DRV_CS_MCU: A01_POWER_MCU (U1.43), A07_BUS_CONTROL (R16.1)
DRV_CS_N: A02_DRV8316 (U2.36), A07_BUS_CONTROL (R16.2 R18.2)
DRV_DRVOFF: A01_POWER_MCU (U1.11), A02_DRV8316 (U2.21), A07_BUS_CONTROL (R10.2)
DRV_NFAULT_N: A02_DRV8316 (U2.22), A06_LINKS_POWER (R13.2 U6.2)
DRV_NSLEEP: A02_DRV8316 (U2.23), A07_BUS_CONTROL (C20.1 R11.2 R12.1)
DRV_NSLEEP_MCU: A01_POWER_MCU (U1.34), A07_BUS_CONTROL (R11.1)
DRV_SCK: A02_DRV8316 (U2.35), A07_BUS_CONTROL (R14.2)
DRV_SCK_MCU: A01_POWER_MCU (U1.40), A07_BUS_CONTROL (R14.1)
DRV_SDI: A02_DRV8316 (U2.34), A07_BUS_CONTROL (R15.2)
DRV_SDI_MCU: A01_POWER_MCU (U1.42), A07_BUS_CONTROL (R15.1)
DRV_SDO: A01_POWER_MCU (U1.41), A02_DRV8316 (U2.33), A07_BUS_CONTROL (R17.2)
ENC_CS_MCU: A01_POWER_MCU (U1.12), A05_ENCODER_NTC (R31.1)
ENC_MISO_MCU: A01_POWER_MCU (U1.14), A05_ENCODER_NTC (R34.2)
ENC_MOSI_MCU: A01_POWER_MCU (U1.15), A05_ENCODER_NTC (R33.1)
ENC_SCK_MCU: A01_POWER_MCU (U1.13), A05_ENCODER_NTC (R32.1)
GND: A01_POWER_MCU (22 pins), A02_DRV8316 (22 pins), A03_CURRENT_ADC (11 pins), A04_HARD_PROTECT (14 pins), A05_ENCODER_NTC (5 pins), A06_LINKS_POWER (17 pins), A07_BUS_CONTROL (11 pins)
HARD_FAULT_N: A01_POWER_MCU (U1.26), A04_HARD_PROTECT (7 pins), A06_LINKS_POWER (J5.7 R19.2 U6.4)
I2C_SCL: A01_POWER_MCU (U1.39), A06_LINKS_POWER (J5.3 J6.6 R7.2)
I2C_SDA: A01_POWER_MCU (U1.44), A06_LINKS_POWER (J5.4 J6.7 R8.2)
MOTOR_BUS: A02_DRV8316 (10 pins), A03_CURRENT_ADC (R67.1), A04_HARD_PROTECT (6 pins), A07_BUS_CONTROL (7 pins)
MOTOR_PWR_EN: A06_LINKS_POWER (J5.8), A07_BUS_CONTROL (R46.2 R47.1)
MOTOR_PWR_EN_MCU: A01_POWER_MCU (U1.46), A07_BUS_CONTROL (R46.1)
MOTOR_TEMP_ADC: A01_POWER_MCU (U1.18), A05_ENCODER_NTC (C50.1 R40.2)
MOTOR_U: A02_DRV8316 (U2.13 U2.14), A07_BUS_CONTROL (J2.1)
MOTOR_V: A02_DRV8316 (U2.16 U2.17), A07_BUS_CONTROL (J2.2)
MOTOR_W: A02_DRV8316 (U2.19 U2.20), A07_BUS_CONTROL (J2.3)
NRST: A01_POWER_MCU (C10.1 R4.2 U1.7), A06_LINKS_POWER (J4.5 SW1.1 SW1.2)
PWM_HA_MCU: A01_POWER_MCU (U1.30), A02_DRV8316 (R20.1)
PWM_HB_MCU: A01_POWER_MCU (U1.31), A02_DRV8316 (R22.1)
PWM_HC_MCU: A01_POWER_MCU (U1.32), A02_DRV8316 (R24.1)
PWM_LA_MCU: A01_POWER_MCU (U1.27), A02_DRV8316 (R21.1)
PWM_LB_MCU: A01_POWER_MCU (U1.28), A02_DRV8316 (R23.1)
PWM_LC_MCU: A01_POWER_MCU (U1.29), A02_DRV8316 (R25.1)
SOA_ADC: A01_POWER_MCU (U1.8), A03_CURRENT_ADC (C41.1 R50.2)
SOA_CMP: A03_CURRENT_ADC (C42.1 R51.2), A04_HARD_PROTECT (U3.5 U3.6)
SOA_RAW: A02_DRV8316 (U2.40), A03_CURRENT_ADC (R49.1)
SOB_ADC: A01_POWER_MCU (U1.9), A03_CURRENT_ADC (C43.1 R53.2)
SOB_CMP: A03_CURRENT_ADC (C44.1 R54.2), A04_HARD_PROTECT (U3.9 U3.10)
SOB_RAW: A02_DRV8316 (U2.39), A03_CURRENT_ADC (R52.1)
SOC_ADC: A01_POWER_MCU (U1.16), A03_CURRENT_ADC (C45.1 R56.2)
SOC_CMP: A03_CURRENT_ADC (C46.1 R57.2), A04_HARD_PROTECT (U4.5 U4.6)
SOC_RAW: A02_DRV8316 (U2.38), A03_CURRENT_ADC (R55.1)
STM_UART_RX: A01_POWER_MCU (U1.25), A06_LINKS_POWER (R37.2 R71.2)
STM_UART_TX: A01_POWER_MCU (U1.22), A06_LINKS_POWER (U8.5)
SWCLK: A01_POWER_MCU (U1.38), A06_LINKS_POWER (J4.4)
SWDIO: A01_POWER_MCU (U1.37), A06_LINKS_POWER (J4.2)
SYS_FAULT_N_MCU: A01_POWER_MCU (U1.2), A06_LINKS_POWER (R9.1 U7.2)
VBUS_ADC: A01_POWER_MCU (U1.17), A03_CURRENT_ADC (C49.1 R70.2)